# EAGLE schematic PCIe-1x-Toolcard (EAGLE 9.2.1)

## Sheet 1 of 8: PCIe x1 Edge Connector
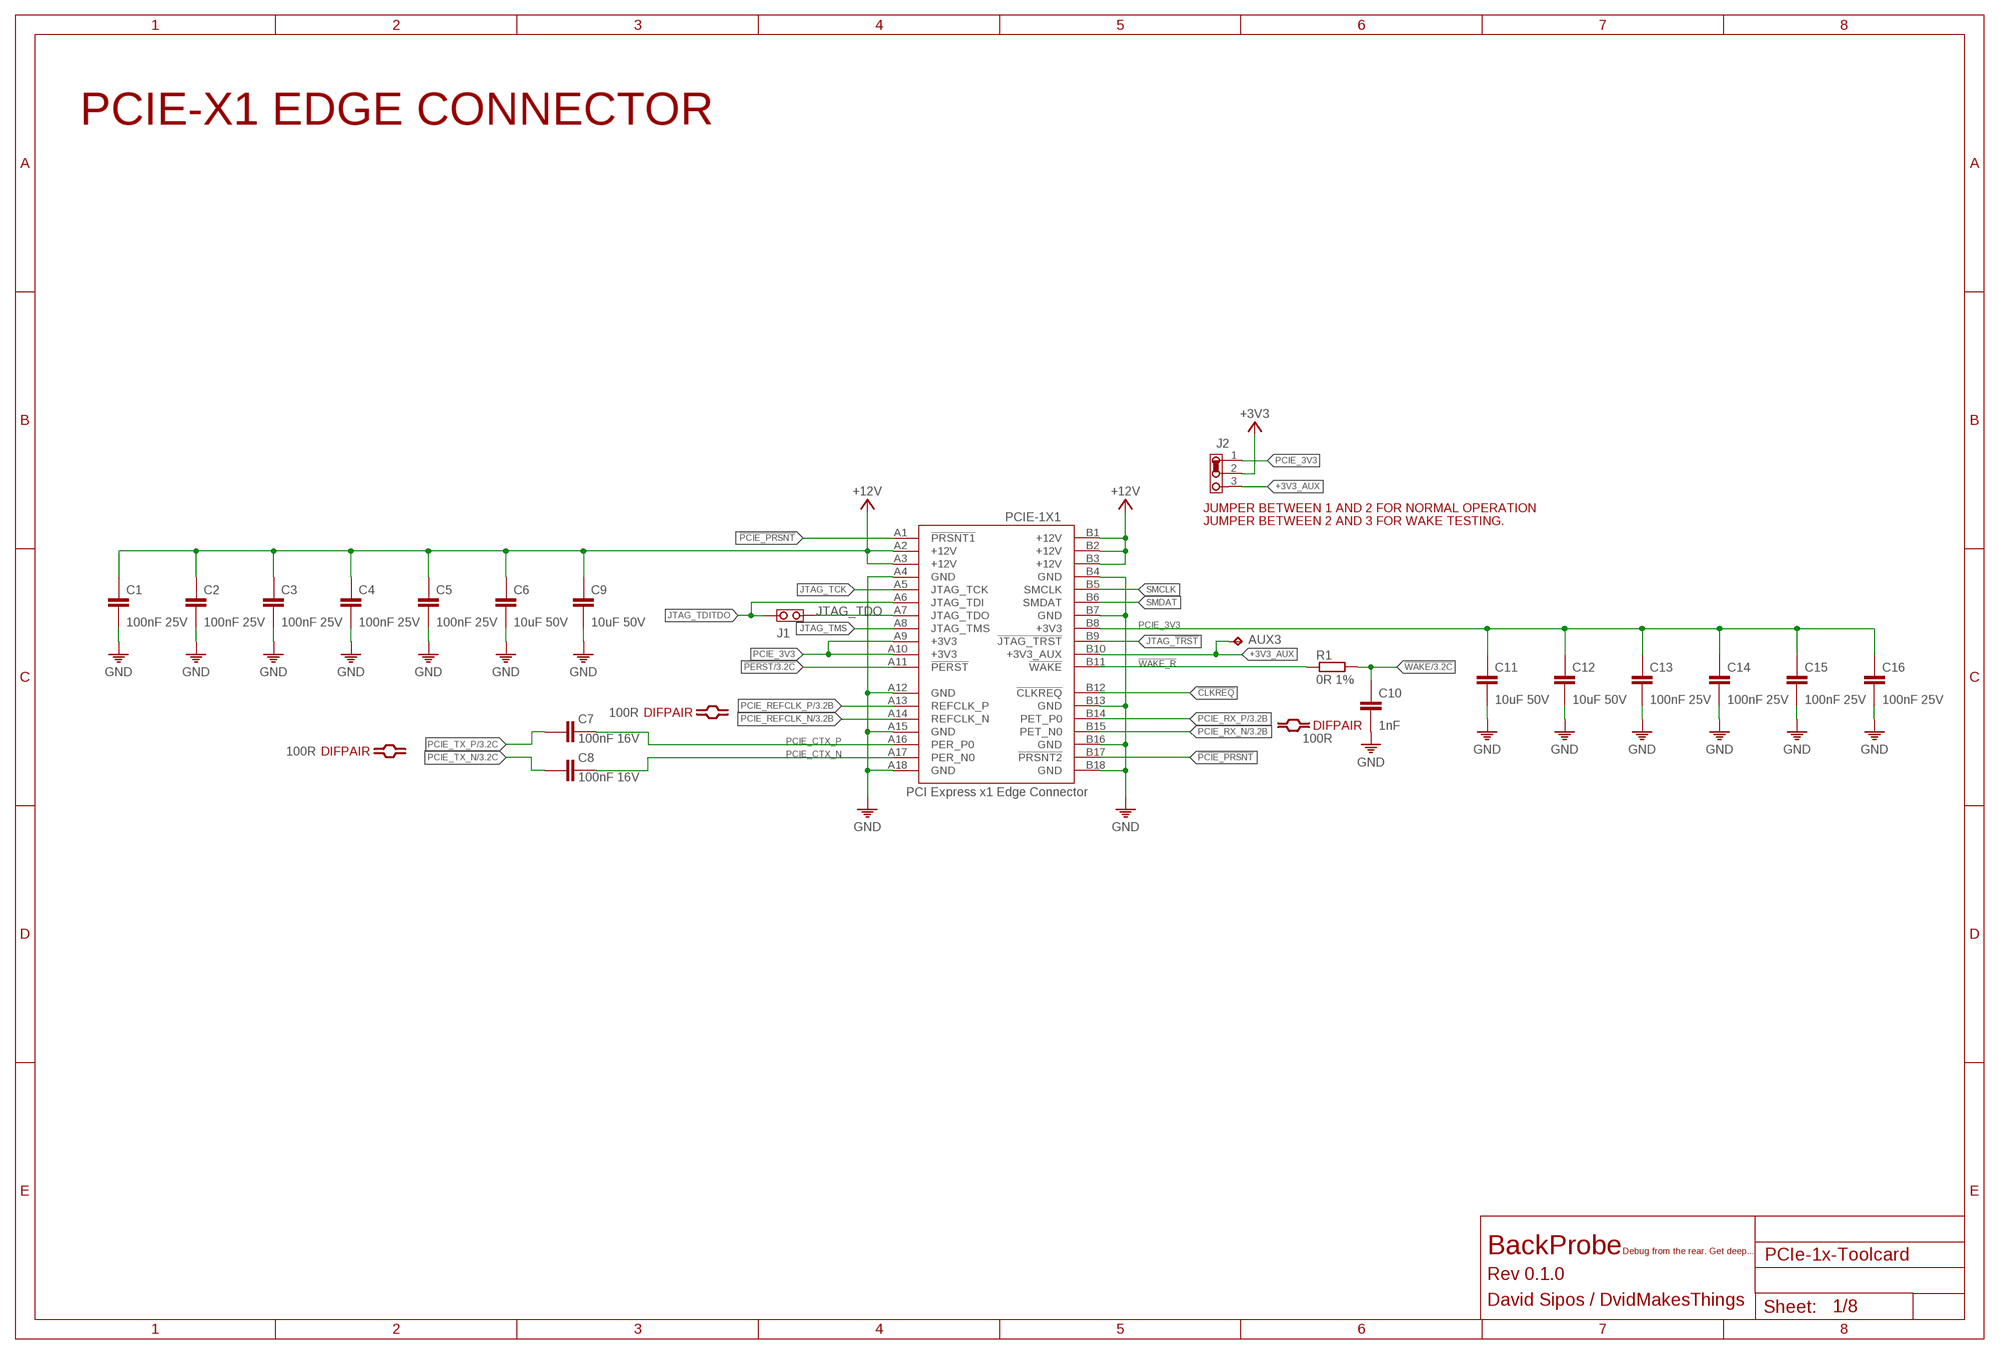
[diagram p0: schematic, sheet 1]

### Parts
AUX3  TPB1,27  [B1,27]
C1  100nF 25V  100NF-25V-0402  [0402]
C2  100nF 25V  100NF-25V-0402  [0402]
C3  100nF 25V  100NF-25V-0402  [0402]
C4  100nF 25V  100NF-25V-0402  [0402]
C5  100nF 25V  100NF-25V-0402  [0402]
C6  10uF 50V  10UF-50V-0805  [0805]
C7  100nF 16V  100NF-16V-0201  [0201]
C8  100nF 16V  100NF-16V-0201  [0201]
C9  10uF 50V  10UF-50V-0805  [0805]
C10  1nF  C-0402  [C0402]
C11  10uF 50V  10UF-50V-0805  [0805]
C12  10uF 50V  10UF-50V-0805  [0805]
C13  100nF 25V  100NF-25V-0402  [0402]
C14  100nF 25V  100NF-25V-0402  [0402]
C15  100nF 25V  100NF-25V-0402  [0402]
C16  100nF 25V  100NF-25V-0402  [0402]
J1  JUMPER-NO  [J-0402-NO]
J2  JUMPER-3  [JUMPER-3]
PCIE-1X1  PCI Express x1 Edge Connector  PCIE-1X-LOWPROFILE  [PCIE_X1_LOWPROFILE]
R1  0R 1%  0R0201  [0201]

### Nets
!CLKREQ: PCIE-1X1.B12(!CLKREQ)
!PCIE_PRSNT: PCIE-1X1.A1(!PRSNT1) PCIE-1X1.B17(!PRSNT2)
!PERST: PCIE-1X1.A11(!PERST) ; also sheet 3
!WAKE: C10.1 R1.2 ; also sheet 3
!WAKE_R: PCIE-1X1.B11(!WAKE) R1.1
+3V3: J2.2 ; also sheet 2,3,4
+3V3_AUX: AUX3.TP J2.3 PCIE-1X1.B10(+3V3_AUX)
+12V: C1.1 C2.1 C3.1 C4.1 C5.1 C6.1 C9.1 PCIE-1X1.A2(+12V) PCIE-1X1.A3(+12V) PCIE-1X1.B1(+12V) PCIE-1X1.B2(+12V) PCIE-1X1.B3(+12V) ; also sheet 4
GND: C1.2 C2.2 C3.2 C4.2 C5.2 C6.2 C9.2 C10.2 C11.2 C12.2 C13.2 C14.2 C15.2 C16.2 PCIE-1X1.A4(GND) PCIE-1X1.A12(GND) PCIE-1X1.A15(GND) PCIE-1X1.A18(GND) PCIE-1X1.B4(GND) PCIE-1X1.B7(GND) PCIE-1X1.B13(GND) PCIE-1X1.B16(GND) PCIE-1X1.B18(GND) ; also sheet 2,3,4,5,6,7,8
JTAG_!TRST: PCIE-1X1.B9(!JTAG_TRST)
JTAG_TCK: PCIE-1X1.A5(JTAG_TCK)
JTAG_TDITDO: J1.1 PCIE-1X1.A6(JTAG_TDI)
JTAG_TDO: J1.2 PCIE-1X1.A7(JTAG_TDO)
JTAG_TMS: PCIE-1X1.A8(JTAG_TMS)
PCIE_3V3: C11.1 C12.1 C13.1 C14.1 C15.1 C16.1 J2.1 PCIE-1X1.A9(+3V3) PCIE-1X1.A10(+3V3) PCIE-1X1.B8(+3V3)
PCIE_CTX_N [100R_DE]: C8.2 PCIE-1X1.A17(PER_N0)
PCIE_CTX_P [100R_DE]: C7.2 PCIE-1X1.A16(PER_P0)
PCIE_REFCLK_N [100R_DE]: PCIE-1X1.A14(REFCLK_N) ; also sheet 3
PCIE_REFCLK_P [100R_DE]: PCIE-1X1.A13(REFCLK_P) ; also sheet 3
PCIE_RX_N [100R_DE]: PCIE-1X1.B15(PET_N0) ; also sheet 3
PCIE_RX_P [100R_DE]: PCIE-1X1.B14(PET_P0) ; also sheet 3
PCIE_TX_N [100R_DE]: C8.1 ; also sheet 3
PCIE_TX_P [100R_DE]: C7.1 ; also sheet 3
SMCLK: PCIE-1X1.B5(SMCLK)
SMDAT: PCIE-1X1.B6(SMDAT)

### Notes on the sheet
- PCIE-X1 EDGE CONNECTOR
- JUMPER BETWEEN 1 AND 2 FOR NORMAL OPERATION
- JUMPER BETWEEN 2 AND 3 FOR WAKE TESTING.
- BackProbe | Debug from the rear. Get deep...
- Rev 0.1.0
- David Sipos / DvidMakesThings

## Sheet 2 of 8: TUSB7340 Power
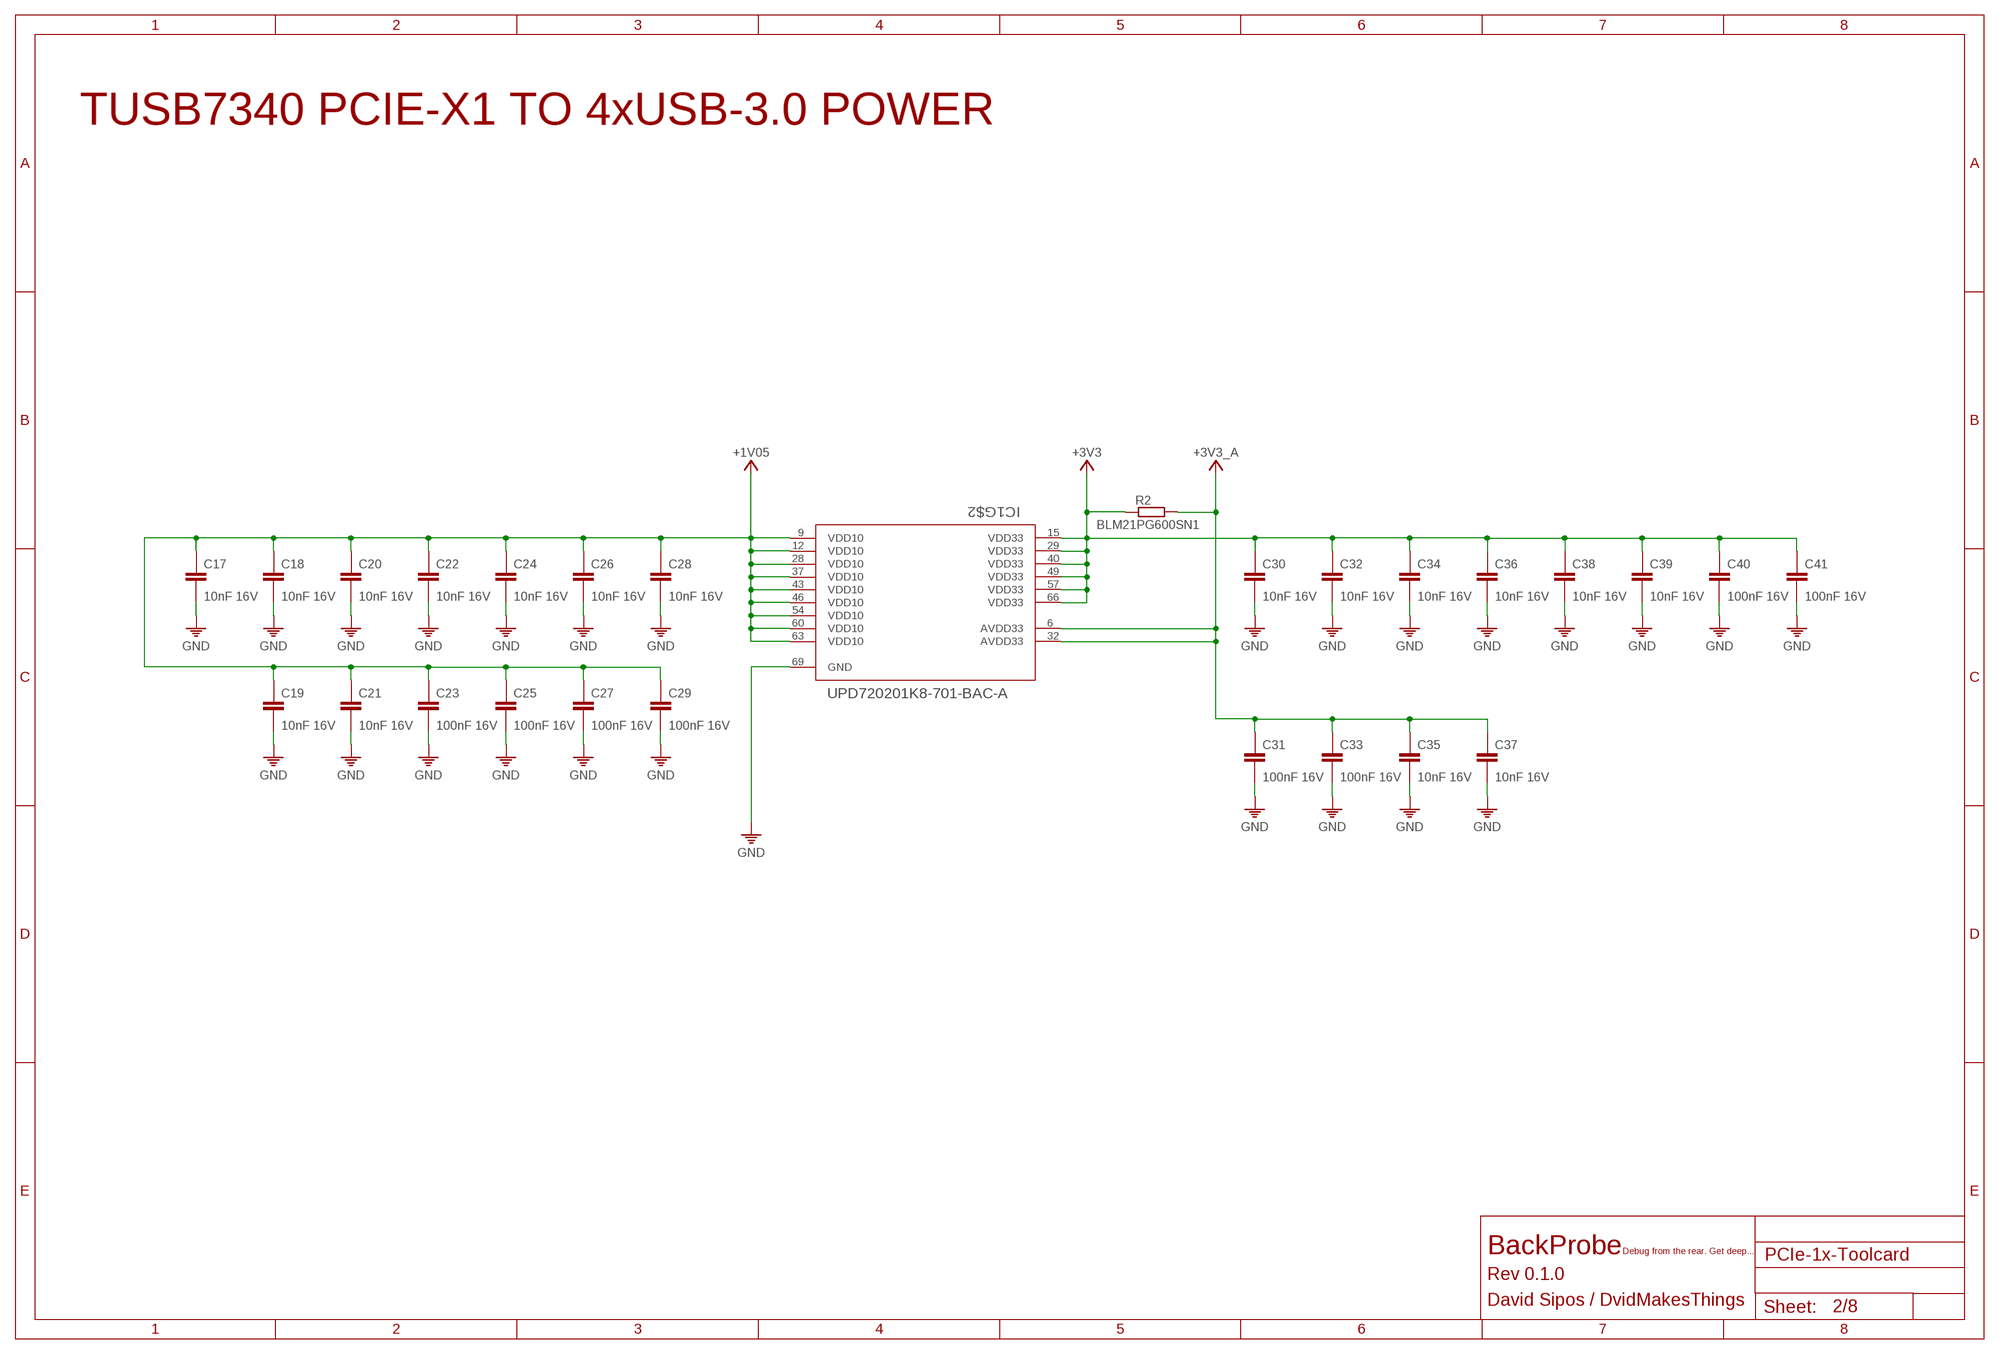
[diagram p1: schematic, sheet 2]

### Parts
C17  10nF 16V  10NF-16V-0201  [0201]
C18  10nF 16V  10NF-16V-0201  [0201]
C19  10nF 16V  10NF-16V-0201  [0201]
C20  10nF 16V  10NF-16V-0201  [0201]
C21  10nF 16V  10NF-16V-0201  [0201]
C22  10nF 16V  10NF-16V-0201  [0201]
C23  100nF 16V  100NF-16V-0201  [0201]
C24  10nF 16V  10NF-16V-0201  [0201]
C25  100nF 16V  100NF-16V-0201  [0201]
C26  10nF 16V  10NF-16V-0201  [0201]
C27  100nF 16V  100NF-16V-0201  [0201]
C28  10nF 16V  10NF-16V-0201  [0201]
C29  100nF 16V  100NF-16V-0201  [0201]
C30  10nF 16V  10NF-16V-0201  [0201]
C31  100nF 16V  100NF-16V-0201  [0201]
C32  10nF 16V  10NF-16V-0201  [0201]
C33  100nF 16V  100NF-16V-0201  [0201]
C34  10nF 16V  10NF-16V-0201  [0201]
C35  10nF 16V  10NF-16V-0201  [0201]
C36  10nF 16V  10NF-16V-0201  [0201]
C37  10nF 16V  10NF-16V-0201  [0201]
C38  10nF 16V  10NF-16V-0201  [0201]
C39  10nF 16V  10NF-16V-0201  [0201]
C40  100nF 16V  100NF-16V-0201  [0201]
C41  100nF 16V  100NF-16V-0201  [0201]
IC1  UPD720201K8-701-BAC-A  UPD720201  [QFN68-8X8]
R2  BLM21PG600SN1  R0603  [0603]

### Nets
+1V05: C17.1 C18.1 C19.1 C20.1 C21.1 C22.1 C23.1 C24.1 C25.1 C26.1 C27.1 C28.1 C29.1 IC1.9(VDD10) IC1.12(VDD10) IC1.28(VDD10) IC1.37(VDD10) IC1.43(VDD10) IC1.46(VDD10) IC1.54(VDD10) IC1.60(VDD10) IC1.63(VDD10) ; also sheet 4
+3V3: C30.1 C32.1 C34.1 C36.1 C38.1 C39.1 C40.1 C41.1 IC1.15(VDD33) IC1.29(VDD33) IC1.40(VDD33) IC1.49(VDD33) IC1.57(VDD33) IC1.66(VDD33) R2.1 ; also sheet 1,3,4
+3V3A: C31.1 C33.1 C35.1 C37.1 IC1.6(AVDD33) IC1.32(AVDD33) R2.2 ; supply symbol labelled +3V3_A
GND: C17.2 C18.2 C19.2 C20.2 C21.2 C22.2 C23.2 C24.2 C25.2 C26.2 C27.2 C28.2 C29.2 C30.2 C31.2 C32.2 C33.2 C34.2 C35.2 C36.2 C37.2 C38.2 C39.2 C40.2 C41.2 IC1.69(GND) ; also sheet 1,3,4,5,6,7,8

### Notes on the sheet
- TUSB7340 PCIE-X1 TO 4xUSB-3.0 POWER
- BackProbe | Debug from the rear. Get deep...
- Rev 0.1.0
- David Sipos / DvidMakesThings

## Sheet 3 of 8: TUSB7340 Wiring
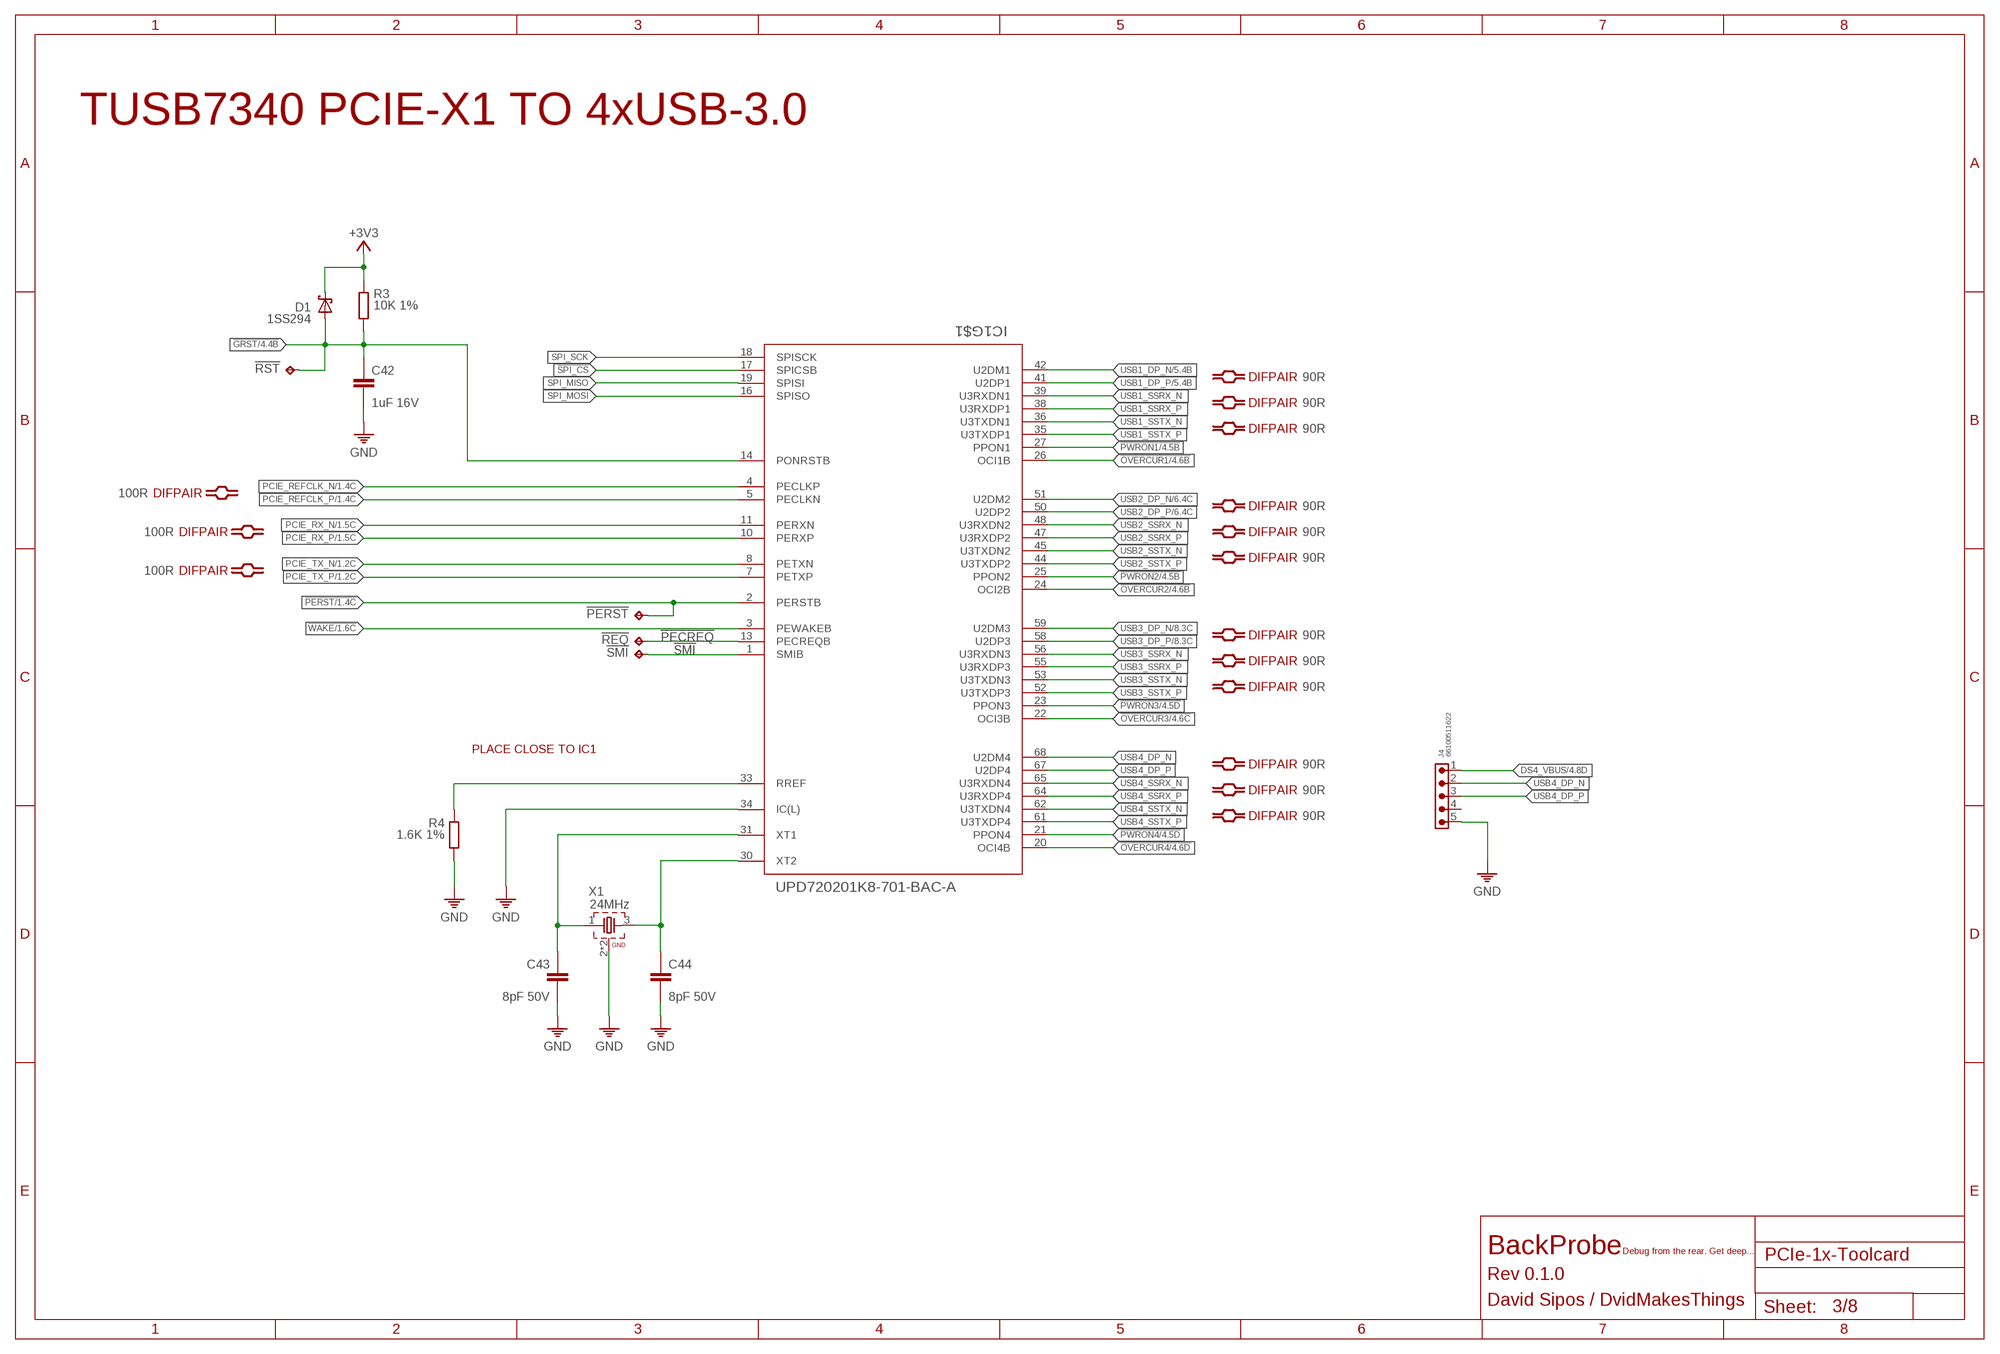
[diagram p2: schematic, sheet 3]

### Parts
!PERST  TPB1,27  [B1,27]
!REQ  TPB1,27  [B1,27]
!RST  TPB1,27  [B1,27]
!SMI  TPB1,27  [B1,27]
C42  1uF 16V  1UF-16V0201  [0201]
C43  8pF 50V  8PF-50V0201  [0201]
C44  8pF 50V  8PF-50V0201  [0201]
D1  1SS294  BAT54  [SOT23]
J4  66100511622  66100511622  [66100511622]
R3  10K 1%  10K-1%0201  [0201]
R4  1.6K 1%  1.6K-1%0201  [0201]
X1  24MHz  WE-XTAL_CFPX-180_830108207709  [WE-XTAL_CFPX-180]

### Nets
!GRST: !RST.TP C42.1 D1.1(A) IC1.14(PONRSTB) R3.2 ; also sheet 4
!OVERCUR1: IC1.26(OCI1B) ; also sheet 4
!OVERCUR2: IC1.24(OCI2B) ; also sheet 4
!OVERCUR3: IC1.22(OCI3B) ; also sheet 4
!OVERCUR4: IC1.20(OCI4B) ; also sheet 4
!PECREQ: !REQ.TP IC1.13(PECREQB)
!PERST: !PERST.TP IC1.2(PERSTB) ; also sheet 1
!PWRON1: IC1.27(PPON1) ; also sheet 4
!PWRON2: IC1.25(PPON2) ; also sheet 4
!PWRON3: IC1.23(PPON3) ; also sheet 4
!PWRON4: IC1.21(PPON4) ; also sheet 4
!SMI: !SMI.TP IC1.1(SMIB)
!SPI_CS: IC1.17(SPICSB)
!WAKE: IC1.3(PEWAKEB) ; also sheet 1
+3V3: D1.3(C) R3.1 ; also sheet 1,2,4
DS4_VBUS: J4.1 ; also sheet 4
GND: C42.2 C43.2 C44.2 IC1.34(IC(L)) J4.5 R4.2 X1.2(GND) X1.4(GND) ; also sheet 1,2,4,5,6,7,8
N$4: C43.1 IC1.31(XT1) X1.1
N$5: C44.1 IC1.30(XT2) X1.3
N$60: IC1.33(RREF) R4.1
PCIE_REFCLK_N [100R_DE]: IC1.4(PECLKP) ; also sheet 1
PCIE_REFCLK_P [100R_DE]: IC1.5(PECLKN) ; also sheet 1
PCIE_RX_N [100R_DE]: IC1.11(PERXN) ; also sheet 1
PCIE_RX_P [100R_DE]: IC1.10(PERXP) ; also sheet 1
PCIE_TX_N [100R_DE]: IC1.8(PETXN) ; also sheet 1
PCIE_TX_P [100R_DE]: IC1.7(PETXP) ; also sheet 1
SPI_MISO: IC1.19(SPISI)
SPI_MOSI: IC1.16(SPISO)
SPI_SCK: IC1.18(SPISCK)
USB1_DP_N [90R_DE]: IC1.42(U2DM1) ; also sheet 5
USB1_DP_P [90R_DE]: IC1.41(U2DP1) ; also sheet 5
USB1_SSRX_N [90R_DE]: IC1.39(U3RXDN1)
USB1_SSRX_P [90R_DE]: IC1.38(U3RXDP1)
USB1_SSTX_N [90R_DE]: IC1.36(U3TXDN1)
USB1_SSTX_P [90R_DE]: IC1.35(U3TXDP1)
USB2_DP_N [90R_DE]: IC1.51(U2DM2) ; also sheet 6
USB2_DP_P [90R_DE]: IC1.50(U2DP2) ; also sheet 6
USB2_SSRX_N [90R_DE]: IC1.48(U3RXDN2)
USB2_SSRX_P [90R_DE]: IC1.47(U3RXDP2)
USB2_SSTX_N [90R_DE]: IC1.45(U3TXDN2)
USB2_SSTX_P [90R_DE]: IC1.44(U3TXDP2)
USB3_DP_N [90R_DE]: IC1.59(U2DM3) ; also sheet 8
USB3_DP_P [90R_DE]: IC1.58(U2DP3) ; also sheet 8
USB3_SSRX_N [90R_DE]: IC1.56(U3RXDN3)
USB3_SSRX_P [90R_DE]: IC1.55(U3RXDP3)
USB3_SSTX_N [90R_DE]: IC1.53(U3TXDN3)
USB3_SSTX_P [90R_DE]: IC1.52(U3TXDP3)
USB4_DP_N [90R_DE]: IC1.68(U2DM4) J4.2
USB4_DP_P [90R_DE]: IC1.67(U2DP4) J4.3
USB4_SSRX_N [90R_DE]: IC1.65(U3RXDN4)
USB4_SSRX_P [90R_DE]: IC1.64(U3RXDP4)
USB4_SSTX_N [90R_DE]: IC1.62(U3TXDN4)
USB4_SSTX_P [90R_DE]: IC1.61(U3TXDP4)
Unconnected: J4.4

### Notes on the sheet
- TUSB7340 PCIE-X1 TO 4xUSB-3.0
- PLACE CLOSE TO IC1
- BackProbe | Debug from the rear. Get deep...
- Rev 0.1.0
- David Sipos / DvidMakesThings

## Sheet 4 of 8: Power Management
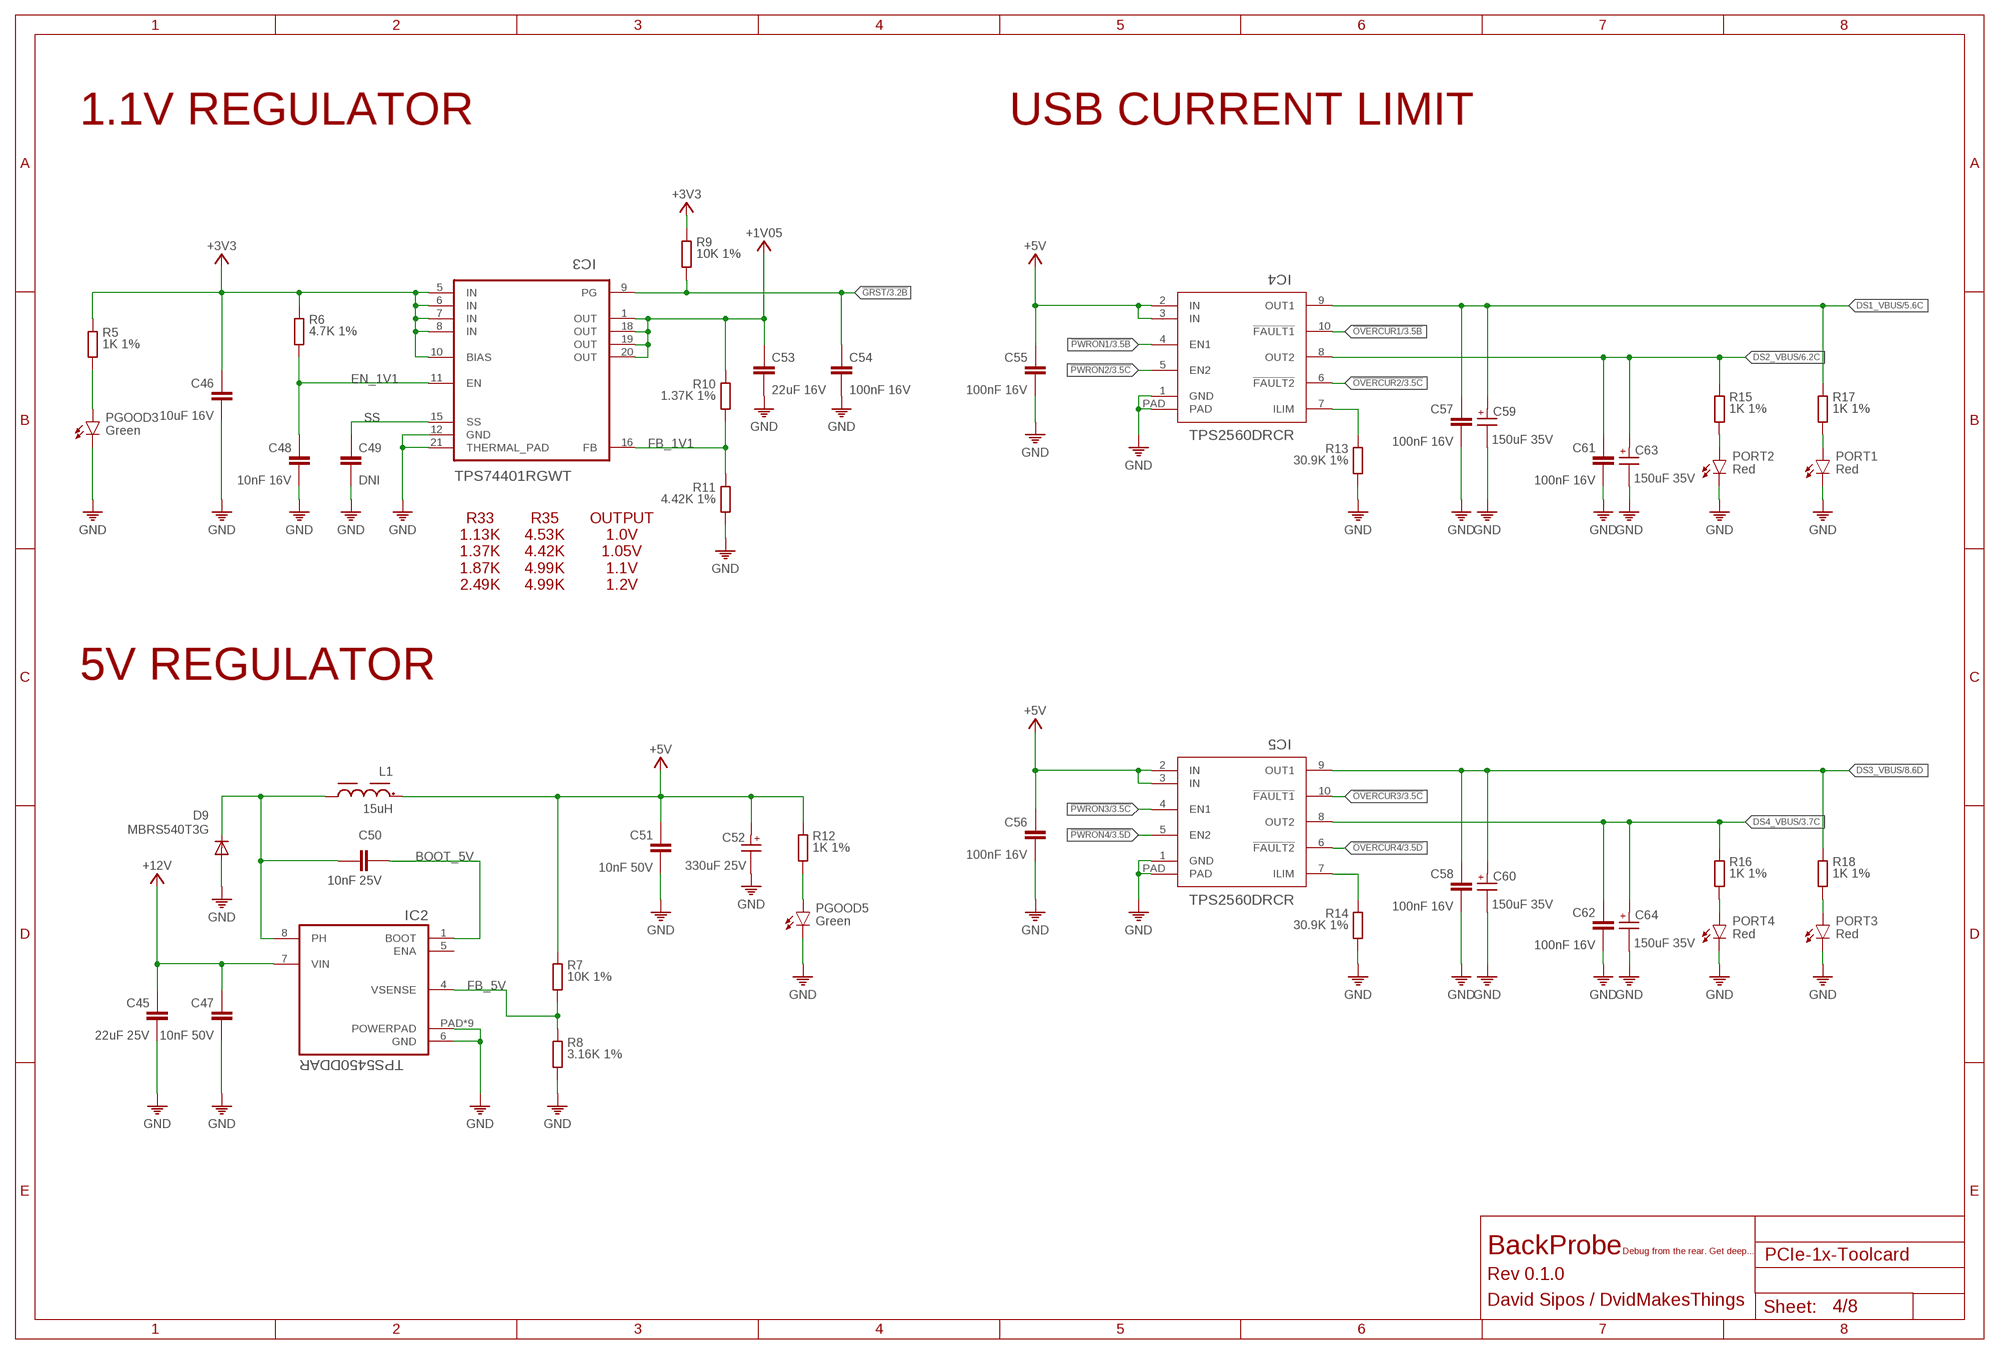
[diagram p3: schematic, sheet 4]

### Parts
C45  22uF 25V  22UF-25V-0805  [0805]
C46  10uF 16V  10UF-16V-0805  [0805]
C47  10nF 50V  10NF-50V-0805  [0805]
C48  10nF 16V  10NF-16V-0201  [0201]
C49  DNI  C-0201  [0201]
C50  10nF 25V  10NF-25V-0402  [0402]
C51  10nF 50V  10NF-50V-0805  [0805]
C52  330uF 25V  330UF-25V6.3X7.7(DXL)  [6.3X7.7(DXL)]
C53  22uF 16V  22UF-16V-0805  [0805]
C54  100nF 16V  100NF-16V-0201  [0201]
C55  100nF 16V  100NF-16V-0201  [0201]
C56  100nF 16V  100NF-16V-0201  [0201]
C57  100nF 16V  100NF-16V-0201  [0201]
C58  100nF 16V  100NF-16V-0201  [0201]
C59  150uF 35V  150UF-35V-6.3X5.5  [6.3X5.5(DXL)]
C60  150uF 35V  150UF-35V-6.3X5.5  [6.3X5.5(DXL)]
C61  100nF 16V  100NF-16V-0201  [0201]
C62  100nF 16V  100NF-16V-0201  [0201]
C63  150uF 35V  150UF-35V-6.3X5.5  [6.3X5.5(DXL)]
C64  150uF 35V  150UF-35V-6.3X5.5  [6.3X5.5(DXL)]
D9  MBRS540T3G  DIODE-SMC  [SMC]
IC2  TPS5450DDAR  TPS5450  [8-POWERSOIC]
IC3  TPS74401RGWT  [VQFN20-5X5]
IC4  TPS2560DRCR  [VSON10-3X3]
IC5  TPS2560DRCR  [VSON10-3X3]
L1  15uH  15UHL-10X10  [L-10X10]
PGOOD3  Green  LED-GREENLED-0603  [LED-0603]
PGOOD5  Green  LED-GREENLED-0603  [LED-0603]
PORT1  Red  LED-REDLED-0603  [LED-0603]
PORT2  Red  LED-REDLED-0603  [LED-0603]
PORT3  Red  LED-REDLED-0603  [LED-0603]
PORT4  Red  LED-REDLED-0603  [LED-0603]
R5  1K 1%  1K-1%0402  [0402]
R6  4.7K 1%  4.7K-1%0201  [0201]
R7  10K 1%  10K-1%0402  [0402]
R8  3.16K 1%  3.16K-1%0402  [0402]
R9  10K 1%  10K-1%0201  [0201]
R10  1.37K 1%  1.37K-1%0201  [0201]
R11  4.42K 1%  4.42K-1%0201  [0201]
R12  1K 1%  1K-1%0402  [0402]
R13  30.9K 1%  30.9K-1%0201  [0201]
R14  30.9K 1%  30.9K-1%0201  [0201]
R15  1K 1%  1K-1%0402  [0402]
R16  1K 1%  1K-1%0402  [0402]
R17  1K 1%  1K-1%0402  [0402]
R18  1K 1%  1K-1%0402  [0402]

### Nets
!GRST: C54.1 IC3.9(PG) R9.2 ; also sheet 3
!OVERCUR1: IC4.10(!FAULT1) ; also sheet 3
!OVERCUR2: IC4.6(!FAULT2) ; also sheet 3
!OVERCUR3: IC5.10(!FAULT1) ; also sheet 3
!OVERCUR4: IC5.6(!FAULT2) ; also sheet 3
!PWRON1: IC4.4(EN1) ; also sheet 3
!PWRON2: IC4.5(EN2) ; also sheet 3
!PWRON3: IC5.4(EN1) ; also sheet 3
!PWRON4: IC5.5(EN2) ; also sheet 3
+1V05: C53.1 IC3.1(OUT) IC3.18(OUT) IC3.19(OUT) IC3.20(OUT) R10.1 ; also sheet 2
+3V3: C46.1 IC3.5(IN) IC3.6(IN) IC3.7(IN) IC3.8(IN) IC3.10(BIAS) R5.1 R6.1 R9.1 ; also sheet 1,2,3
+5V: C51.1 C52.1(+) C55.1 C56.1 IC4.2(IN) IC4.3(IN) IC5.2(IN) IC5.3(IN) L1.1 R7.1 R12.1
+12V: C45.1 C47.1 IC2.7(VIN) ; also sheet 1
BOOT_5V: C50.1 IC2.1(BOOT)
DS1_VBUS: C57.1 C59.1(+) IC4.9(OUT1) R17.1 ; also sheet 5
DS2_VBUS: C61.1 C63.1(+) IC4.8(OUT2) R15.1 ; also sheet 6,7
DS3_VBUS: C58.1 C60.1(+) IC5.9(OUT1) R18.1 ; also sheet 8
DS4_VBUS: C62.1 C64.1(+) IC5.8(OUT2) R16.1 ; also sheet 3
EN_1V1: C48.1 IC3.11(EN) R6.2
FB_1V1: IC3.16(FB) R10.2 R11.1
FB_5V: IC2.4(VSENSE) R7.2 R8.1
GND: C45.2 C46.2 C47.2 C48.2 C49.2 C51.2 C52.2(-) C53.2 C54.2 C55.2 C56.2 C57.2 C58.2 C59.2(-) C60.2(-) C61.2 C62.2 C63.2(-) C64.2(-) D9.A IC2.6(GND) IC2.PAD(POWERPAD) IC2.V1(POWERPAD) IC2.V2(POWERPAD) IC2.V3(POWERPAD) IC2.V4(POWERPAD) IC2.V5(POWERPAD) IC2.V6(POWERPAD) IC2.V7(POWERPAD) IC2.V8(POWERPAD) IC3.12(GND) IC3.21(THERMAL_PAD) IC4.1(GND) IC4.PAD IC5.1(GND) IC5.PAD PGOOD3.C PGOOD5.C PORT1.C PORT2.C PORT3.C PORT4.C R8.2 R11.2 R13.2 R14.2 ; also sheet 1,2,3,5,6,7,8
ILIM12: IC4.7(ILIM) R13.1
ILIM34: IC5.7(ILIM) R14.1
LED_3V: PGOOD3.A R5.2
LED_5V: PGOOD5.A R12.2
LEDDS1: PORT2.A R15.2
LEDDS2: PORT3.A R18.2
LEDDS3: PORT1.A R17.2
LEDDS4: PORT4.A R16.2
PH: C50.2 D9.C IC2.8(PH) L1.2
SS: C49.1 IC3.15(SS)
Unconnected: IC2.5(ENA)

### Notes on the sheet
- 1.1V REGULATOR | USB CURRENT LIMIT
- R33
  1.13K
  1.37K
  1.87K
  2.49K
- R35
  4.53K
  4.42K
  4.99K
  4.99K
- OUTPUT
  1.0V
  1.05V
  1.1V
  1.2V
- 5V REGULATOR
- BackProbe | Debug from the rear. Get deep...
- Rev 0.1.0
- David Sipos / DvidMakesThings

## Sheet 5 of 8: Downstream port 1
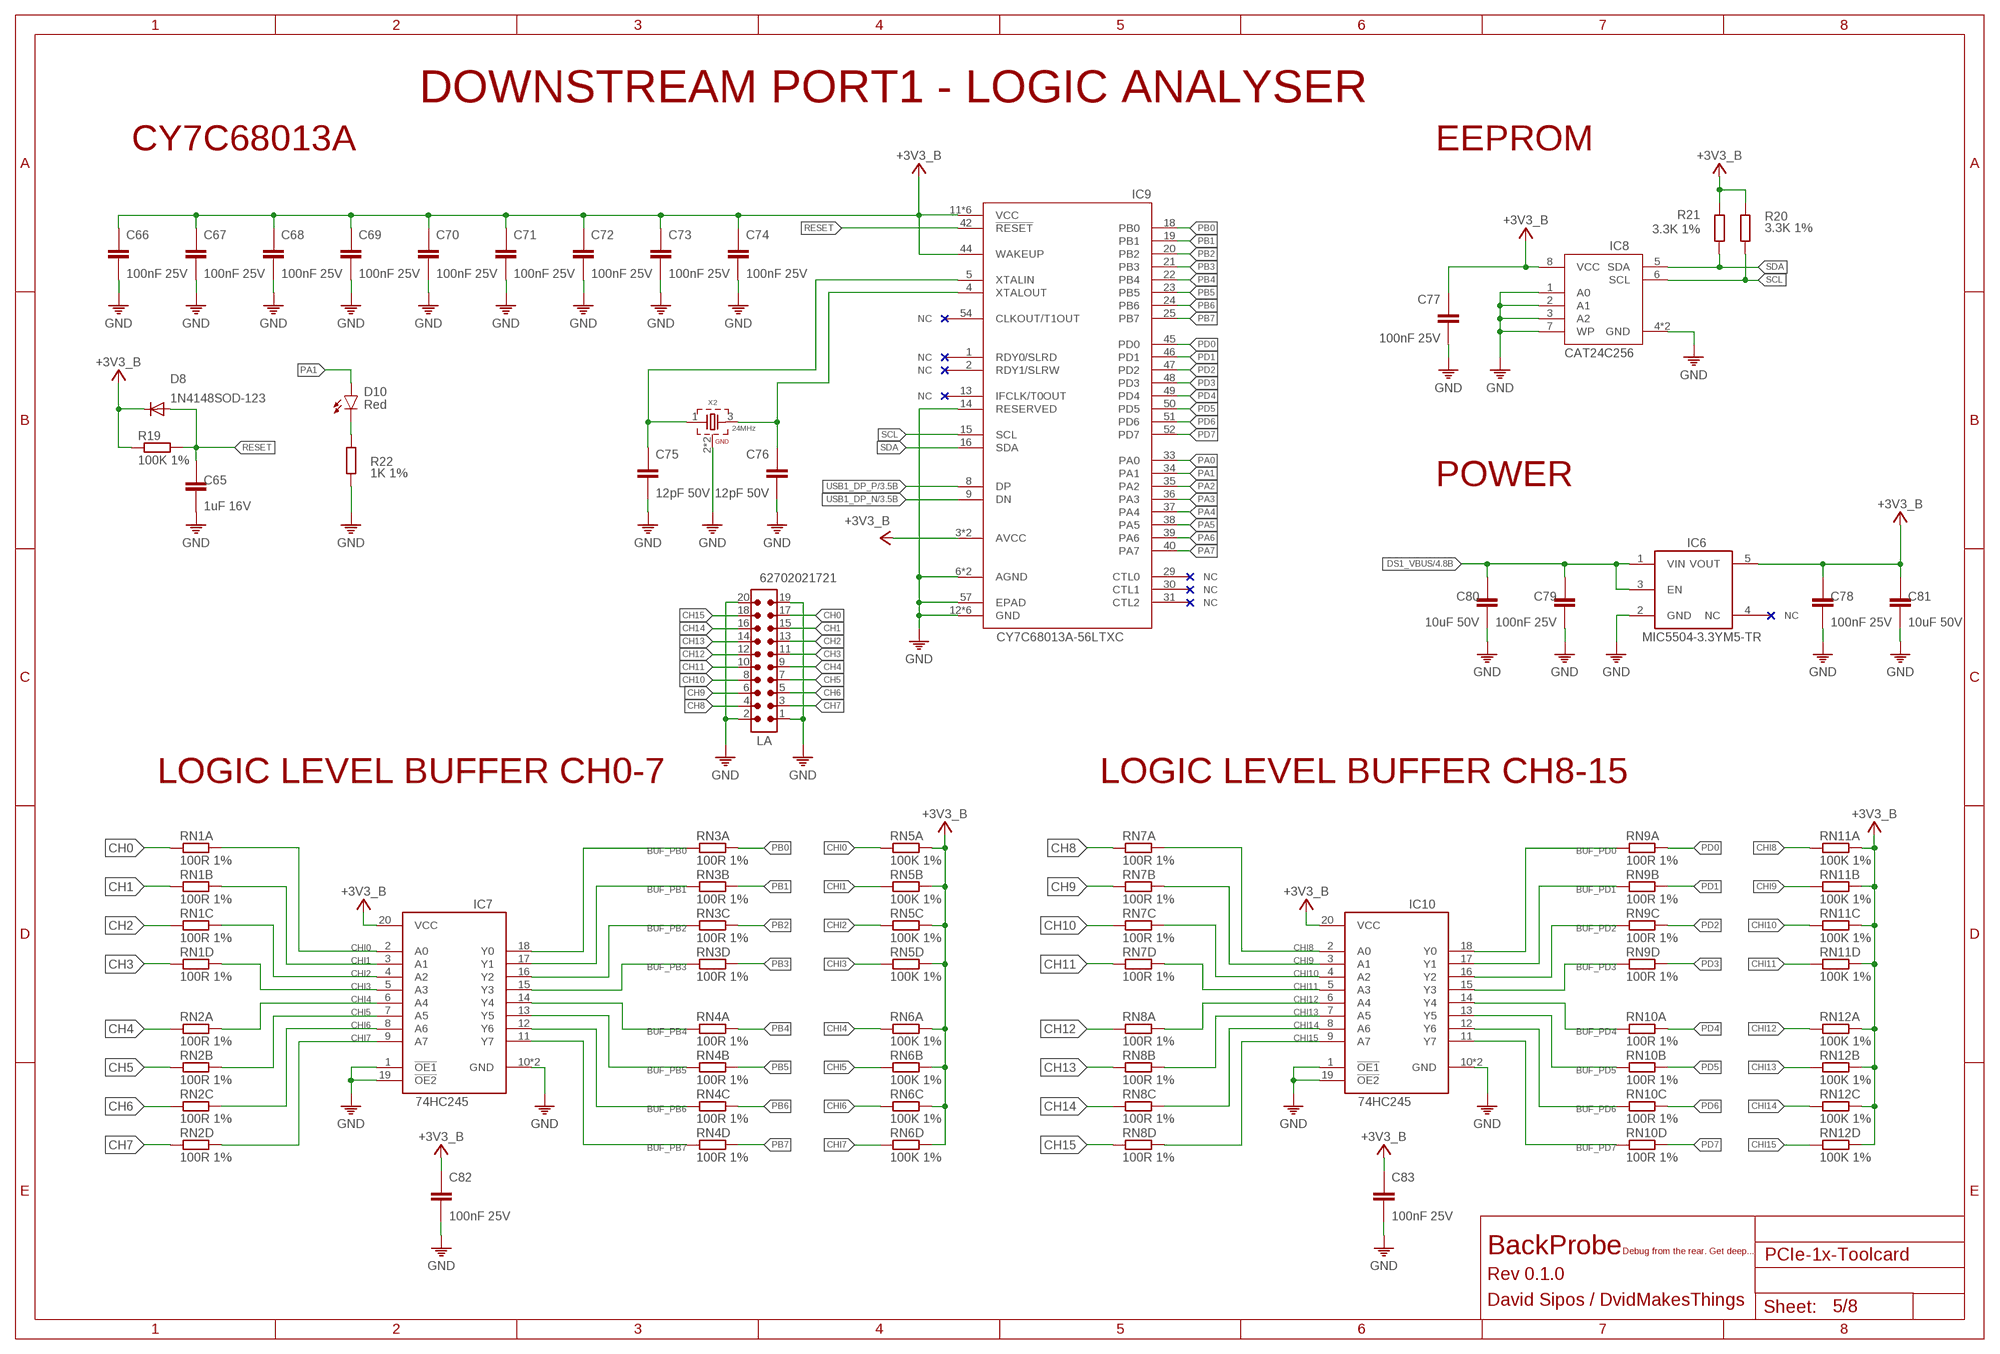
[diagram p4: schematic, sheet 5]

### Parts
C65  1uF 16V  1UF-16V0201  [0201]
C66  100nF 25V  100NF-25V-0201  [0201]
C67  100nF 25V  100NF-25V-0201  [0201]
C68  100nF 25V  100NF-25V-0201  [0201]
C69  100nF 25V  100NF-25V-0201  [0201]
C70  100nF 25V  100NF-25V-0201  [0201]
C71  100nF 25V  100NF-25V-0201  [0201]
C72  100nF 25V  100NF-25V-0201  [0201]
C73  100nF 25V  100NF-25V-0201  [0201]
C74  100nF 25V  100NF-25V-0201  [0201]
C75  12pF 50V  12PF-50V0201  [0201]
C76  12pF 50V  12PF-50V0201  [0201]
C77  100nF 25V  100NF-25V-0201  [0201]
C78  100nF 25V  100NF-25V-0201  [0201]
C79  100nF 25V  100NF-25V-0201  [0201]
C80  10uF 50V  10UF-50V-0805  [0805]
C81  10uF 50V  10UF-50V-0805  [0805]
C82  100nF 25V  100NF-25V-0201  [0201]
C83  100nF 25V  100NF-25V-0201  [0201]
D8  1N4148SOD-123  DIODE_SOD-123FL  [SOD-123FL]
D10  Red  LED-REDLED-0603  [LED-0603]
IC6  MIC5504-3.3YM5-TR  [SOT23-5]
IC7  SN74LVC541ARGYR  74LVC541A  [QFN50P350X450X100-25T305X205N]
IC8  CAT24C256HU4IGT3  CAT24C256-HU4  [SON50P300X200X50-9T130X140N]
IC9  CY7C68013A-56LTXC  CY7C68013A-56QFNLFXC  [QFN50P800X800X100-57T665]
IC10  SN74LVC541ARGYR  74LVC541A  [QFN50P350X450X100-25T305X205N]
LA  62702021721  6270XX21721_62702021721  [62702021721]
R19  100K 1%  100K-1%0201  [0201]
R20  3.3K 1%  3.3K-1%0201  [0201]
R21  3.3K 1%  3.3K-1%0201  [0201]
R22  1K 1%  1K-1%0402  [0402]
RN1  100R 1%  100R-1%_ARRAY0603X4-1206  [0603X4-1206]
RN2  100R 1%  100R-1%_ARRAY0603X4-1206  [0603X4-1206]
RN3  100R 1%  100R-1%_ARRAY0603X4-1206  [0603X4-1206]
RN4  100R 1%  100R-1%_ARRAY0603X4-1206  [0603X4-1206]
RN5  100K 1%  100K-1%_ARRAY0603X4-1206  [0603X4-1206]
RN6  100K 1%  100K-1%_ARRAY0603X4-1206  [0603X4-1206]
RN7  100R 1%  100R-1%_ARRAY0603X4-1206  [0603X4-1206]
RN8  100R 1%  100R-1%_ARRAY0603X4-1206  [0603X4-1206]
RN9  100R 1%  100R-1%_ARRAY0603X4-1206  [0603X4-1206]
RN10  100R 1%  100R-1%_ARRAY0603X4-1206  [0603X4-1206]
RN11  100K 1%  100K-1%_ARRAY0603X4-1206  [0603X4-1206]
RN12  100K 1%  100K-1%_ARRAY0603X4-1206  [0603X4-1206]
X2  24MHz  WE-XTAL_CFPX-180_830058149  [WE-XTAL_CFPX-180]

### Nets
+3V3B: C66.1 C67.1 C68.1 C69.1 C70.1 C71.1 C72.1 C73.1 C74.1 C77.1 C78.1 C81.1 C82.1 C83.1 D8.C IC6.5(VOUT) IC7.20(VCC) IC8.8(VCC) IC9.3(AVCC) IC9.7(AVCC) IC9.11(VCC) IC9.17(VCC) IC9.27(VCC) IC9.32(VCC) IC9.43(VCC) IC9.44(WAKEUP) IC9.55(VCC) IC10.20(VCC) R19.1 R20.2 R21.2 RN5.A2 RN5.B2 RN5.C2 RN5.D2 RN6.A2 RN6.B2 RN6.C2 RN6.D2 RN11.A2 RN11.B2 RN11.C2 RN11.D2 RN12.A2 RN12.B2 RN12.C2 RN12.D2 ; supply symbol labelled +3V3_B
BUF_PB0: IC7.18(Y0) RN3.A1
BUF_PB1: IC7.17(Y1) RN3.B1
BUF_PB2: IC7.16(Y2) RN3.C1
BUF_PB3: IC7.15(Y3) RN3.D1
BUF_PB4: IC7.14(Y4) RN4.A1
BUF_PB5: IC7.13(Y5) RN4.B1
BUF_PB6: IC7.12(Y6) RN4.C1
BUF_PB7: IC7.11(Y7) RN4.D1
BUF_PD0: IC10.18(Y0) RN9.A1
BUF_PD1: IC10.17(Y1) RN9.B1
BUF_PD2: IC10.16(Y2) RN9.C1
BUF_PD3: IC10.15(Y3) RN9.D1
BUF_PD4: IC10.14(Y4) RN10.A1
BUF_PD5: IC10.13(Y5) RN10.B1
BUF_PD6: IC10.12(Y6) RN10.C1
BUF_PD7: IC10.11(Y7) RN10.D1
CH0: LA.17 RN1.A1
CH1: LA.15 RN1.B1
CH2: LA.13 RN1.C1
CH3: LA.11 RN1.D1
CH4: LA.9 RN2.A1
CH5: LA.7 RN2.B1
CH6: LA.5 RN2.C1
CH7: LA.3 RN2.D1
CH8: LA.4 RN7.A1
CH9: LA.6 RN7.B1
CH10: LA.8 RN7.C1
CH11: LA.10 RN7.D1
CH12: LA.12 RN8.A1
CH13: LA.14 RN8.B1
CH14: LA.16 RN8.C1
CH15: LA.18 RN8.D1
CHI0: IC7.2(A0) RN1.A2 RN5.A1
CHI1: IC7.3(A1) RN1.B2 RN5.B1
CHI2: IC7.4(A2) RN1.C2 RN5.C1
CHI3: IC7.5(A3) RN1.D2 RN5.D1
CHI4: IC7.6(A4) RN2.A2 RN6.A1
CHI5: IC7.7(A5) RN2.B2 RN6.B1
CHI6: IC7.8(A6) RN2.C2 RN6.C1
CHI7: IC7.9(A7) RN2.D2 RN6.D1
CHI8: IC10.2(A0) RN7.A2 RN11.A1
CHI9: IC10.3(A1) RN7.B2 RN11.B1
CHI10: IC10.4(A2) RN7.C2 RN11.C1
CHI11: IC10.5(A3) RN7.D2 RN11.D1
CHI12: IC10.6(A4) RN8.A2 RN12.A1
CHI13: IC10.7(A5) RN8.B2 RN12.B1
CHI14: IC10.8(A6) RN8.C2 RN12.C1
CHI15: IC10.9(A7) RN8.D2 RN12.D1
DS1_VBUS: C79.1 C80.1 IC6.1(VIN) IC6.3(EN) ; also sheet 4
GND: C65.2 C66.2 C67.2 C68.2 C69.2 C70.2 C71.2 C72.2 C73.2 C74.2 C75.2 C76.2 C77.2 C78.2 C79.2 C80.2 C81.2 C82.2 C83.2 IC6.2(GND) IC7.1(!OE1) IC7.10(GND) IC7.19(!OE2) IC7.PAD(GND) IC8.1(A0) IC8.2(A1) IC8.3(A2) IC8.4(GND) IC8.7(WP) IC8.9(GND) IC9.6(AGND) IC9.10(AGND) IC9.12(GND) IC9.14(RESERVED) IC9.26(GND) IC9.28(GND) IC9.41(GND) IC9.53(GND) IC9.56(GND) IC9.57(EPAD) IC10.1(!OE1) IC10.10(GND) IC10.19(!OE2) IC10.PAD(GND) LA.1 LA.2 LA.19 LA.20 R22.2 X2.2(GND) X2.4(GND) ; also sheet 1,2,3,4,6,7,8
LA_LED: D10.C R22.1
PA0: IC9.33(PA0)
PA1: D10.A IC9.34(PA1)
PA2: IC9.35(PA2)
PA3: IC9.36(PA3)
PA4: IC9.37(PA4)
PA5: IC9.38(PA5)
PA6: IC9.39(PA6)
PA7: IC9.40(PA7)
PB0: IC9.18(PB0) RN3.A2
PB1: IC9.19(PB1) RN3.B2
PB2: IC9.20(PB2) RN3.C2
PB3: IC9.21(PB3) RN3.D2
PB4: IC9.22(PB4) RN4.A2
PB5: IC9.23(PB5) RN4.B2
PB6: IC9.24(PB6) RN4.C2
PB7: IC9.25(PB7) RN4.D2
PD0: IC9.45(PD0) RN9.A2
PD1: IC9.46(PD1) RN9.B2
PD2: IC9.47(PD2) RN9.C2
PD3: IC9.48(PD3) RN9.D2
PD4: IC9.49(PD4) RN10.A2
PD5: IC9.50(PD5) RN10.B2
PD6: IC9.51(PD6) RN10.C2
PD7: IC9.52(PD7) RN10.D2
RESET: C65.1 D8.A IC9.42(!RESET) R19.2
SCL: IC8.6(SCL) IC9.15(SCL) R20.1
SDA: IC8.5(SDA) IC9.16(SDA) R21.1
USB1_DP_N [90R_DE]: IC9.9(DN) ; also sheet 3
USB1_DP_P [90R_DE]: IC9.8(DP) ; also sheet 3
XIN: C75.1 IC9.5(XTALIN) X2.1
XOUT: C76.1 IC9.4(XTALOUT) X2.3
Unconnected: IC6.4(NC) IC9.1(RDY0/SLRD) IC9.2(RDY1/SLRW) IC9.13(IFCLK/T0OUT) IC9.29(CTL0) IC9.30(CTL1) IC9.31(CTL2) IC9.54(CLKOUT/T1OUT)

### Notes on the sheet
- DOWNSTREAM PORT1 - LOGIC ANALYSER
- CY7C68013A | EEPROM
- POWER
- LOGIC LEVEL BUFFER CH0-7 | LOGIC LEVEL BUFFER CH8-15
- BackProbe | Debug from the rear. Get deep...
- Rev 0.1.0
- David Sipos / DvidMakesThings

## Sheet 6 of 8: Downstream port 2/1
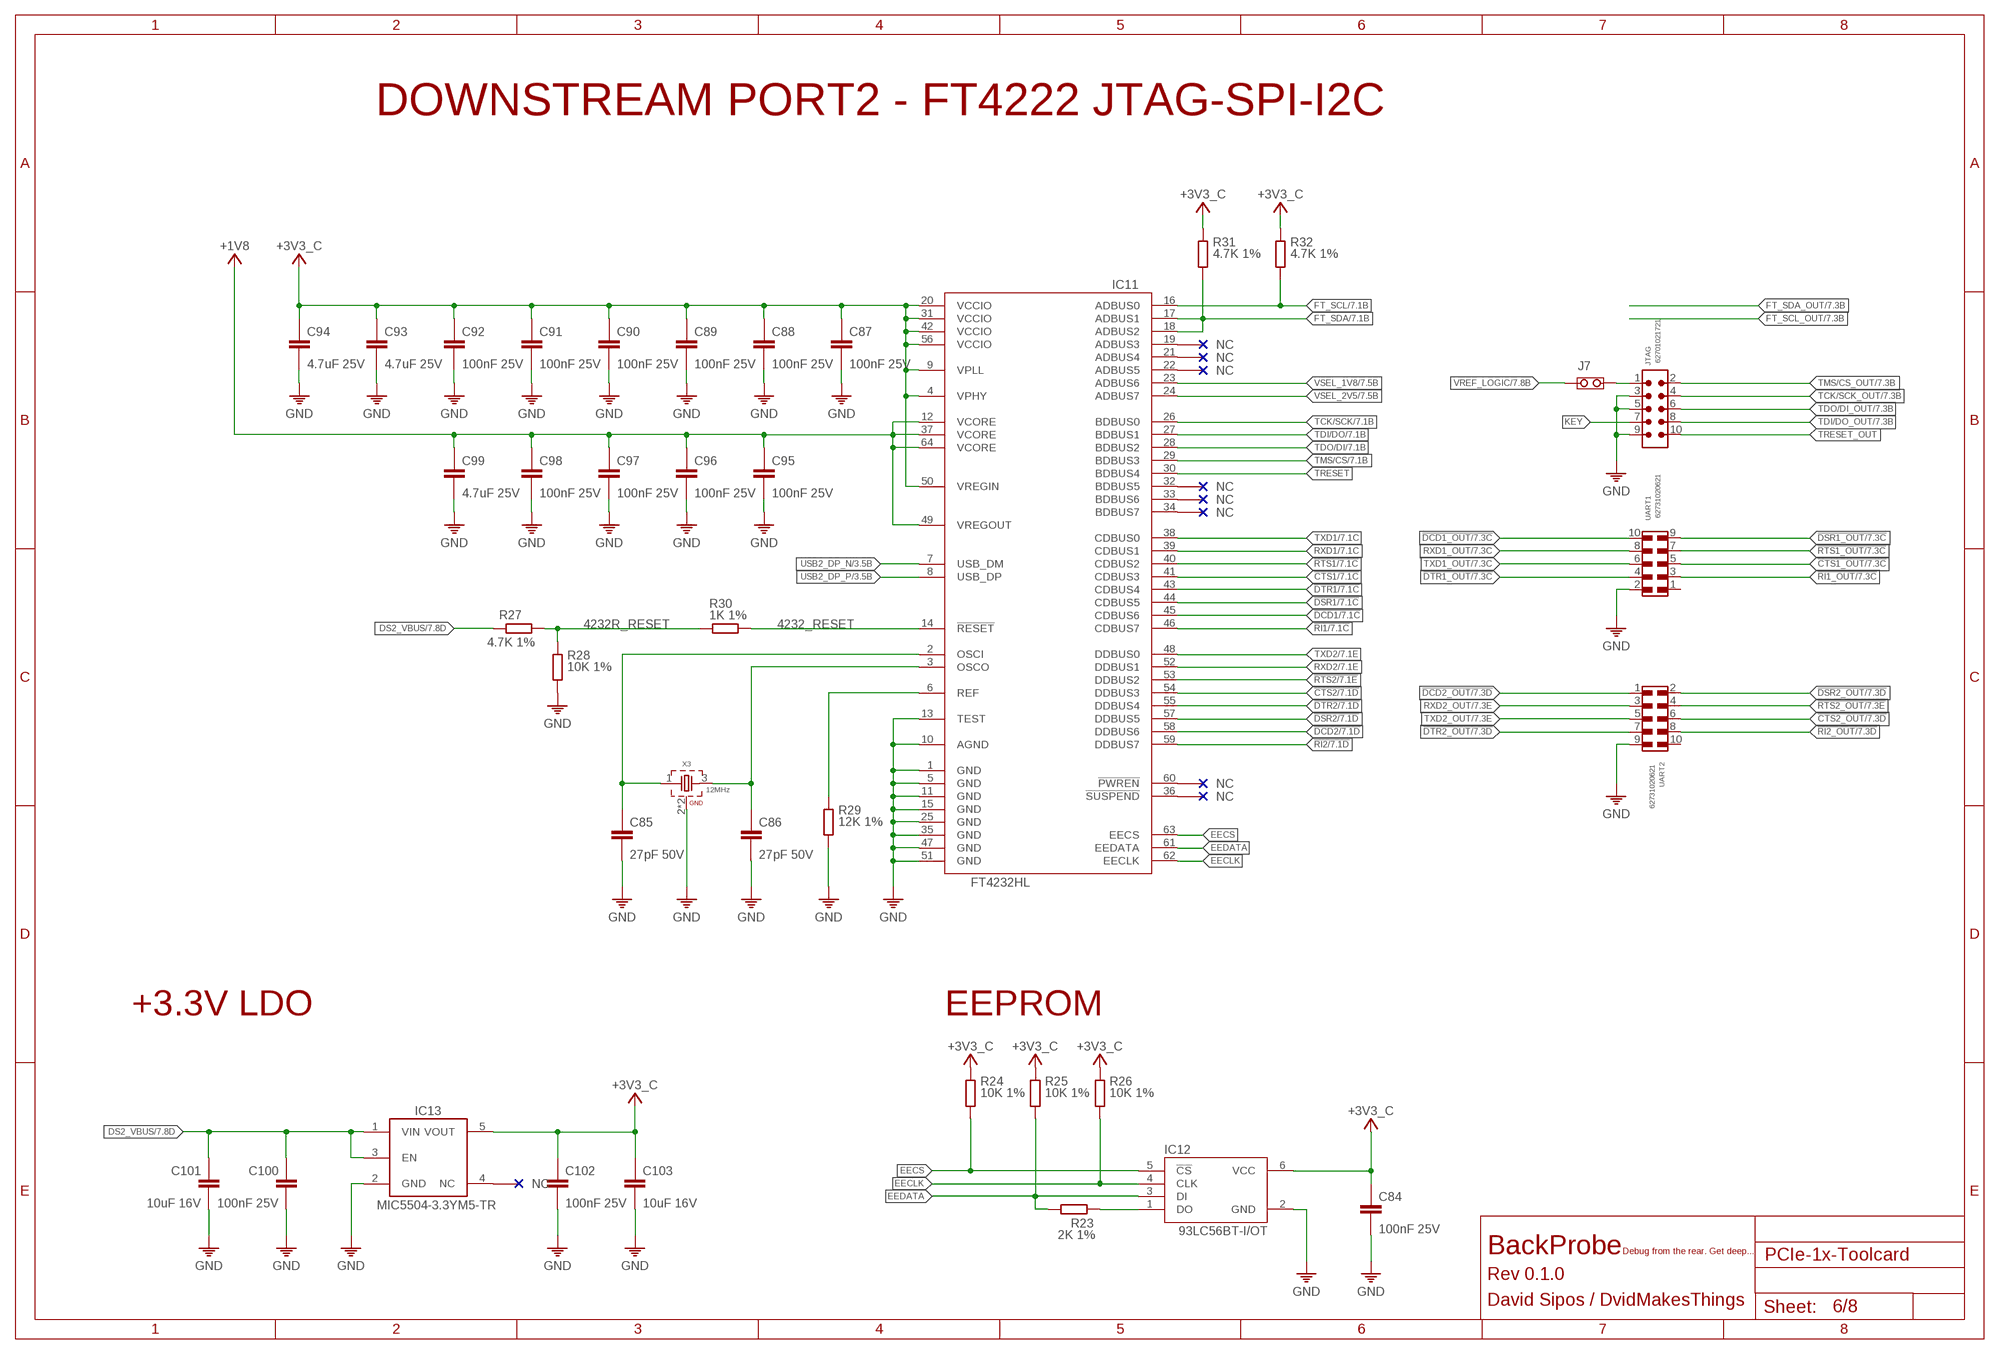
[diagram p5: schematic, sheet 6]

### Parts
C84  100nF 25V  100NF-25V-0402  [0402]
C85  27pF 50V  27PF-50V0201  [0201]
C86  27pF 50V  27PF-50V0201  [0201]
C87  100nF 25V  100NF-25V-0201  [0201]
C88  100nF 25V  100NF-25V-0201  [0201]
C89  100nF 25V  100NF-25V-0201  [0201]
C90  100nF 25V  100NF-25V-0201  [0201]
C91  100nF 25V  100NF-25V-0201  [0201]
C92  100nF 25V  100NF-25V-0201  [0201]
C93  4.7uF 25V  4.7UF-25V0402  [0402]
C94  4.7uF 25V  4.7UF-25V0402  [0402]
C95  100nF 25V  100NF-25V-0201  [0201]
C96  100nF 25V  100NF-25V-0201  [0201]
C97  100nF 25V  100NF-25V-0201  [0201]
C98  100nF 25V  100NF-25V-0201  [0201]
C99  4.7uF 25V  4.7UF-25V0402  [0402]
C100  100nF 25V  100NF-25V-0201  [0201]
C101  10uF 16V  10UF-16V-0603  [0603]
C102  100nF 25V  100NF-25V-0201  [0201]
C103  10uF 16V  10UF-16V-0603  [0603]
IC11  FT4232HL  [LQFP64-10X10]
IC12  93LC56BT-I/OT  [SOT95P280X145-6N]
IC13  MIC5504-3.3YM5  MIC5504-3.3YM5-TR  [SOT23-5]
J7  JUMPER-NO  [J-0402-NO]
JTAG  62701021721  6270XX21721_62701021721  [62701021721]
R23  2K 1%  2K-1%0201  [0201]
R24  10K 1%  10K-1%0201  [0201]
R25  10K 1%  10K-1%0201  [0201]
R26  10K 1%  10K-1%0201  [0201]
R27  4.7K 1%  4.7K-1%0201  [0201]
R28  10K 1%  10K-1%0201  [0201]
R29  12K 1%  12K-1%0201  [0201]
R30  1K 1%  1K-1%0201  [0201]
R31  4.7K 1%  4.7K-1%0201  [0201]
R32  4.7K 1%  4.7K-1%0201  [0201]
UART1  62731020621  6273XX20621_62731020621  [62731020621]
UART2  62731020621  6273XX20621_62731020621  [62731020621]
X3  12MHz  WE-XTAL_CFPX-180_830055295  [WE-XTAL_CFPX-180]

### Nets
4232_RESET: IC11.14(!RESET) R30.2
4232R_RESET: R27.2 R28.1 R30.1
!CTS1: IC11.41(CDBUS3) ; also sheet 7
!CTS1_OUT: UART1.5 ; also sheet 7
!CTS2: IC11.54(DDBUS3) ; also sheet 7
!CTS2_OUT: UART2.6 ; also sheet 7
!DCD1: IC11.45(CDBUS6) ; also sheet 7
!DCD1_OUT: UART1.10 ; also sheet 7
!DCD2: IC11.58(DDBUS6) ; also sheet 7
!DCD2_OUT: UART2.1 ; also sheet 7
!DSR1: IC11.44(CDBUS5) ; also sheet 7
!DSR1_OUT: UART1.9 ; also sheet 7
!DSR2: IC11.57(DDBUS5) ; also sheet 7
!DSR2_OUT: UART2.2 ; also sheet 7
!DTR1: IC11.43(CDBUS4) ; also sheet 7
!DTR1_OUT: UART1.4 ; also sheet 7
!DTR2: IC11.55(DDBUS4) ; also sheet 7
!DTR2_OUT: UART2.7 ; also sheet 7
!RI1: IC11.46(CDBUS7) ; also sheet 7
!RI1_OUT: UART1.3 ; also sheet 7
!RI2: IC11.59(DDBUS7) ; also sheet 7
!RI2_OUT: UART2.8 ; also sheet 7
!RTS1: IC11.40(CDBUS2) ; also sheet 7
!RTS1_OUT: UART1.7 ; also sheet 7
!RTS2: IC11.53(DDBUS2) ; also sheet 7
!RTS2_OUT: UART2.4 ; also sheet 7
+1V8: C95.1 C96.1 C97.1 C98.1 C99.1 IC11.12(VCORE) IC11.37(VCORE) IC11.49(VREGOUT) IC11.64(VCORE)
+3V3C: C84.1 C87.1 C88.1 C89.1 C90.1 C91.1 C92.1 C93.1 C94.1 C102.1 C103.1 IC11.4(VPHY) IC11.9(VPLL) IC11.20(VCCIO) IC11.31(VCCIO) IC11.42(VCCIO) IC11.50(VREGIN) IC11.56(VCCIO) IC12.6(VCC) IC13.5(VOUT) R24.1 R25.1 R26.1 R31.1 R32.1 ; supply symbol labelled +3V3_C ; also sheet 7
DS2_VBUS: C100.1 C101.1 IC13.1(VIN) IC13.3(EN) R27.1 ; also sheet 4,7
EECLK: IC11.62(EECLK) IC12.4(CLK) R26.2
EECS: IC11.63(EECS) IC12.5(!CS) R24.2
EEDATA: IC11.61(EEDATA) IC12.3(DI) R23.2 R25.2
FT_SCL: IC11.16(ADBUS0) R32.2 ; also sheet 7
FT_SDA: IC11.17(ADBUS1) IC11.18(ADBUS2) R31.2 ; also sheet 7
GND: C84.2 C85.2 C86.2 C87.2 C88.2 C89.2 C90.2 C91.2 C92.2 C93.2 C94.2 C95.2 C96.2 C97.2 C98.2 C99.2 C100.2 C101.2 C102.2 C103.2 IC11.1(GND) IC11.5(GND) IC11.10(AGND) IC11.11(GND) IC11.13(TEST) IC11.15(GND) IC11.25(GND) IC11.35(GND) IC11.47(GND) IC11.51(GND) IC12.2(GND) IC13.2(GND) JTAG.3 JTAG.5 JTAG.9 R28.2 R29.2 UART1.2 UART2.9 X3.2(GND) X3.4(GND) ; also sheet 1,2,3,4,5,7,8
KEY: JTAG.7
N$2: IC11.6(REF) R29.1
N$3: C85.1 IC11.2(OSCI) X3.1
N$6: IC12.1(DO) R23.1
N$10: C86.1 IC11.3(OSCO) X3.3
N$15: J7.2 JTAG.1
RXD1: IC11.39(CDBUS1) ; also sheet 7
RXD1_OUT: UART1.8 ; also sheet 7
RXD2: IC11.52(DDBUS1) ; also sheet 7
RXD2_OUT: UART2.3 ; also sheet 7
TCK/SCK: IC11.26(BDBUS0) ; also sheet 7
TCK/SCK_OUT: JTAG.4 ; also sheet 7
TDI/DO: IC11.27(BDBUS1) ; also sheet 7
TDI/DO_OUT: JTAG.8 ; also sheet 7
TDO/DI: IC11.28(BDBUS2) ; also sheet 7
TDO/DI_OUT: JTAG.6 ; also sheet 7
TMS/CS: IC11.29(BDBUS3) ; also sheet 7
TMS/CS_OUT: JTAG.2 ; also sheet 7
TRESET: IC11.30(BDBUS4)
TRESET_OUT: JTAG.10
TXD1: IC11.38(CDBUS0) ; also sheet 7
TXD1_OUT: UART1.6 ; also sheet 7
TXD2: IC11.48(DDBUS0) ; also sheet 7
TXD2_OUT: UART2.5 ; also sheet 7
USB2_DP_N [90R_DE]: IC11.7(USB_DM) ; also sheet 3
USB2_DP_P [90R_DE]: IC11.8(USB_DP) ; also sheet 3
VREF_LOGIC: J7.1 ; also sheet 7
VSEL_1V8: IC11.23(ADBUS6) ; also sheet 7
VSEL_2V5: IC11.24(ADBUS7) ; also sheet 7
Unconnected: IC11.19(ADBUS3) IC11.21(ADBUS4) IC11.22(ADBUS5) IC11.32(BDBUS5) IC11.33(BDBUS6) IC11.34(BDBUS7) IC11.36(!SUSPEND) IC11.60(!PWREN) IC13.4(NC) UART1.1 UART2.10

### Notes on the sheet
- DOWNSTREAM PORT2 - FT4222 JTAG-SPI-I2C
- +3.3V LDO | EEPROM
- BackProbe | Debug from the rear. Get deep...
- Rev 0.1.0
- David Sipos / DvidMakesThings

## Sheet 7 of 8: Downstream port 2/2
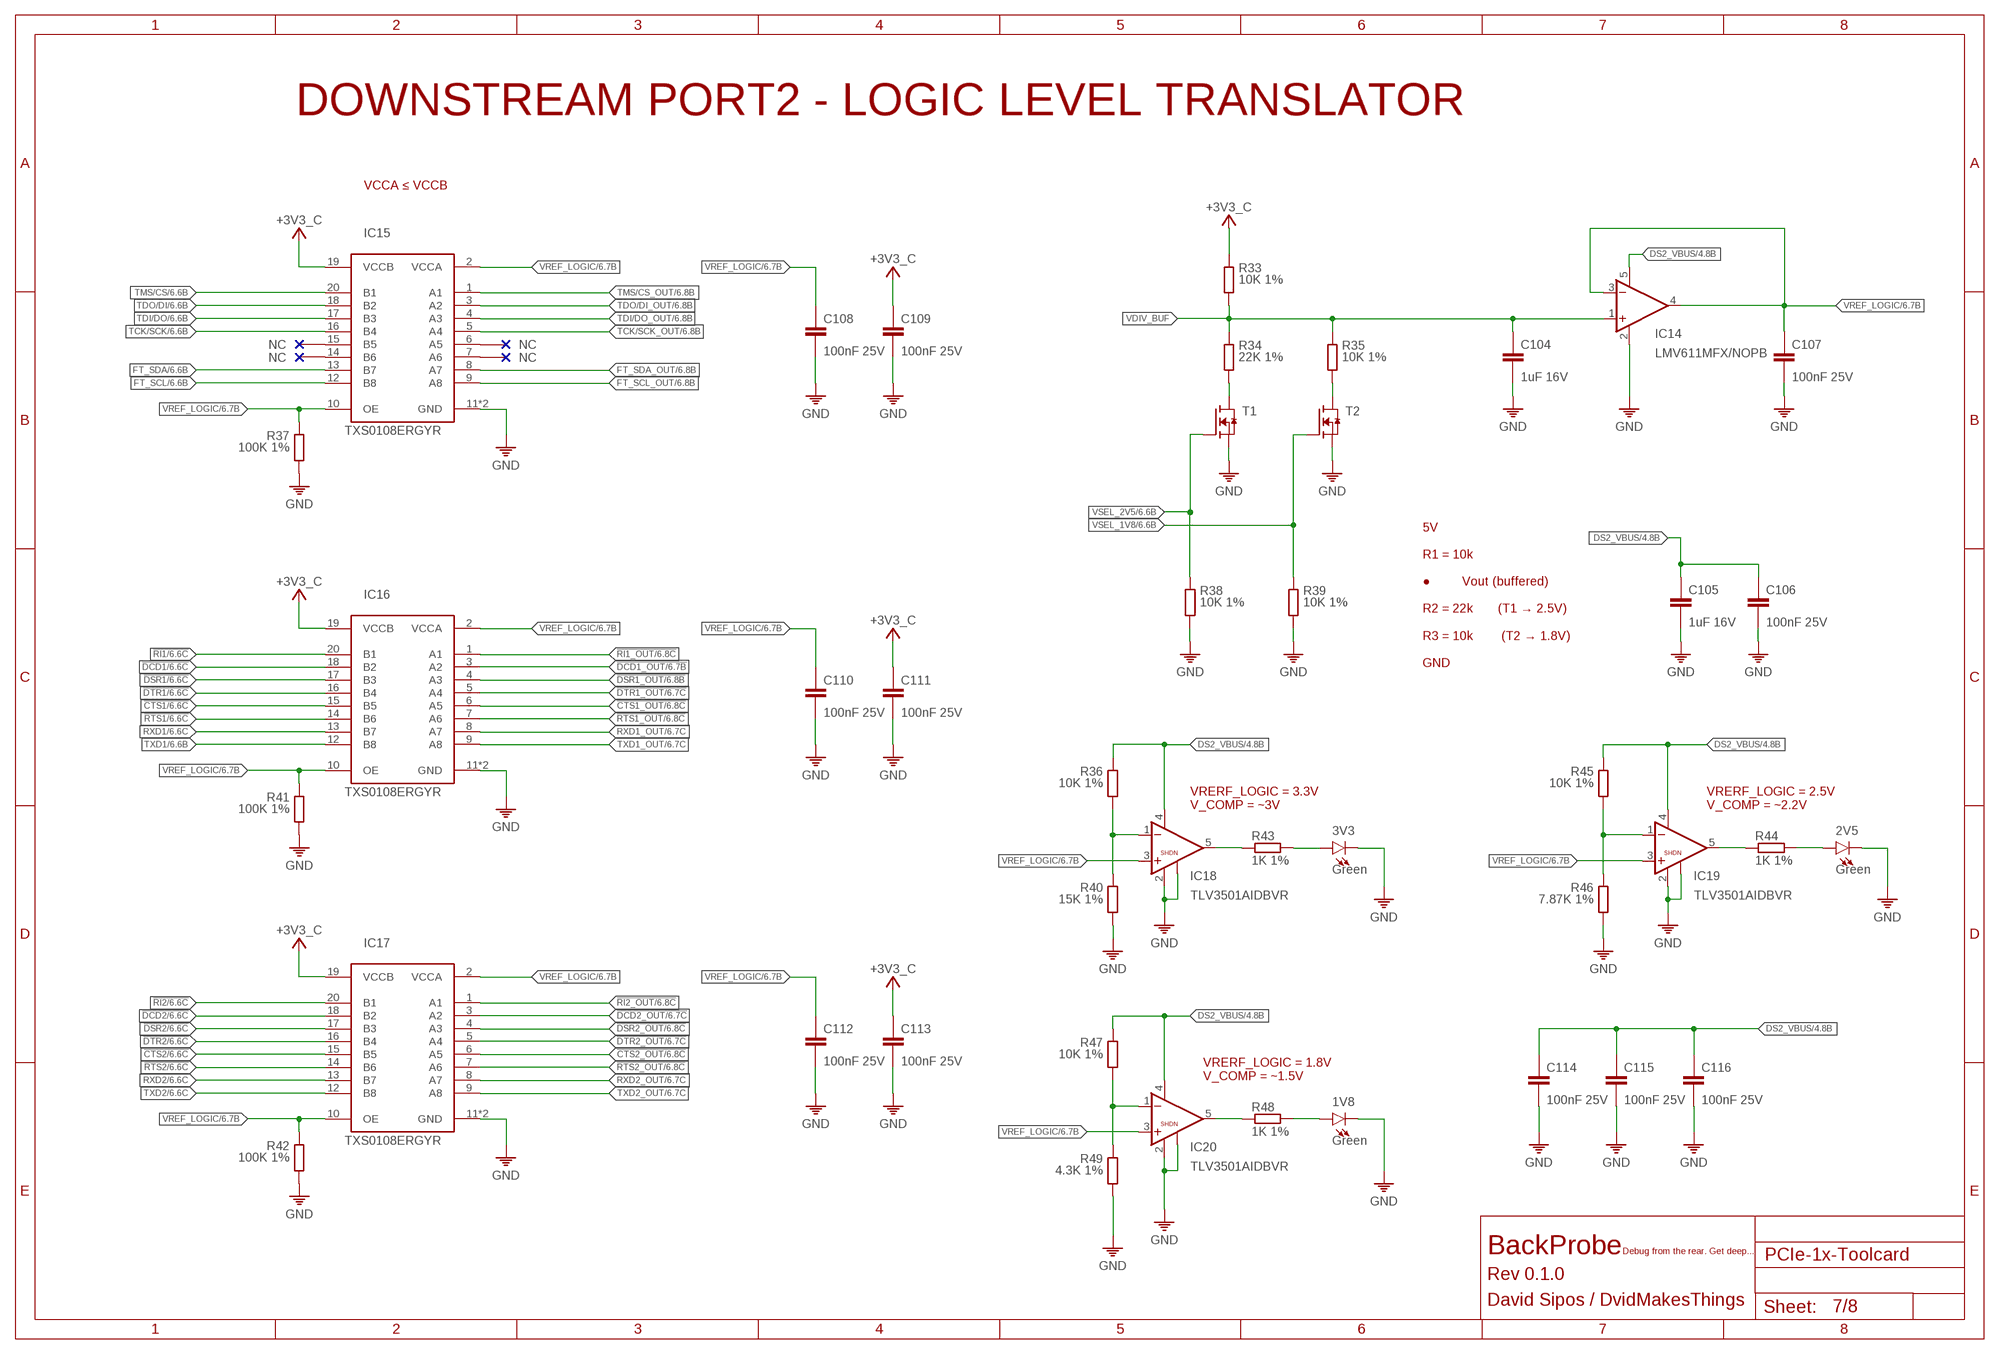
[diagram p6: schematic, sheet 7]

### Parts
1V8  Green  LED-GREENLED-0603  [LED-0603]
2V5  Green  LED-GREENLED-0603  [LED-0603]
3V3  Green  LED-GREENLED-0603  [LED-0603]
C104  1uF 16V  1UF-16V0201  [0201]
C105  1uF 16V  1UF-16V0201  [0201]
C106  100nF 25V  100NF-25V-0201  [0201]
C107  100nF 25V  100NF-25V-0201  [0201]
C108  100nF 25V  100NF-25V-0201  [0201]
C109  100nF 25V  100NF-25V-0201  [0201]
C110  100nF 25V  100NF-25V-0201  [0201]
C111  100nF 25V  100NF-25V-0201  [0201]
C112  100nF 25V  100NF-25V-0201  [0201]
C113  100nF 25V  100NF-25V-0201  [0201]
C114  100nF 25V  100NF-25V-0201  [0201]
C115  100nF 25V  100NF-25V-0201  [0201]
C116  100nF 25V  100NF-25V-0201  [0201]
IC14  LMV611MFX/NOPB  LMV611MFX  [SOT23-5]
IC15  TXS0108ERGYR  TXB0108RGY  [VQFN24]
IC16  TXS0108ERGYR  TXB0108RGY  [VQFN24]
IC17  TXS0108ERGYR  TXB0108RGY  [VQFN24]
IC18  TLV3501AIDBVR  TLV3501AIDB  [SOT95P280X145-6N]
IC19  TLV3501AIDBVR  TLV3501AIDB  [SOT95P280X145-6N]
IC20  TLV3501AIDBVR  TLV3501AIDB  [SOT95P280X145-6N]
R33  10K 1%  10K-1%0402  [0402]
R34  22K 1%  22K-1%0402  [0402]
R35  10K 1%  10K-1%0402  [0402]
R36  10K 1%  10K-1%0201  [0201]
R37  100K 1%  100K-1%0201  [0201]
R38  10K 1%  10K-1%0402  [0402]
R39  10K 1%  10K-1%0402  [0402]
R40  15K 1%  15K-1%0201  [0201]
R41  100K 1%  100K-1%0201  [0201]
R42  100K 1%  100K-1%0201  [0201]
R43  1K 1%  1K-1%0603  [0603]
R44  1K 1%  1K-1%0603  [0603]
R45  10K 1%  10K-1%0201  [0201]
R46  7.87K 1%  7.87K-1%0201  [0201]
R47  10K 1%  10K-1%0201  [0201]
R48  1K 1%  1K-1%0603  [0603]
R49  4.3K 1%  4.3K-1%0201  [0201]
T1  BSS138  [SOT23]
T2  BSS138  [SOT23]

### Nets
!CTS1: IC16.15(B5) ; also sheet 6
!CTS1_OUT: IC16.6(A5) ; also sheet 6
!CTS2: IC17.15(B5) ; also sheet 6
!CTS2_OUT: IC17.6(A5) ; also sheet 6
!DCD1: IC16.18(B2) ; also sheet 6
!DCD1_OUT: IC16.3(A2) ; also sheet 6
!DCD2: IC17.18(B2) ; also sheet 6
!DCD2_OUT: IC17.3(A2) ; also sheet 6
!DSR1: IC16.17(B3) ; also sheet 6
!DSR1_OUT: IC16.4(A3) ; also sheet 6
!DSR2: IC17.17(B3) ; also sheet 6
!DSR2_OUT: IC17.4(A3) ; also sheet 6
!DTR1: IC16.16(B4) ; also sheet 6
!DTR1_OUT: IC16.5(A4) ; also sheet 6
!DTR2: IC17.16(B4) ; also sheet 6
!DTR2_OUT: IC17.5(A4) ; also sheet 6
!RI1: IC16.20(B1) ; also sheet 6
!RI1_OUT: IC16.1(A1) ; also sheet 6
!RI2: IC17.20(B1) ; also sheet 6
!RI2_OUT: IC17.1(A1) ; also sheet 6
!RTS1: IC16.14(B6) ; also sheet 6
!RTS1_OUT: IC16.7(A6) ; also sheet 6
!RTS2: IC17.14(B6) ; also sheet 6
!RTS2_OUT: IC17.7(A6) ; also sheet 6
+3V3C: C109.1 C111.1 C113.1 IC15.19(VCCB) IC16.19(VCCB) IC17.19(VCCB) R33.1 ; supply symbol labelled +3V3_C ; also sheet 6
COMP18_O: IC20.5(OUT) R48.1
COMP25_O: IC19.5(OUT) R44.1
COMP33_O: IC18.5(OUT) R43.1
D25: R35.2 T2.3(D)
D33: R34.2 T1.3(D)
DS2_VBUS: C105.1 C106.1 C114.1 C115.1 C116.1 IC14.5(V+) IC18.4(V+) IC19.4(V+) IC20.4(V+) R36.1 R45.1 R47.1 ; also sheet 4,6
FT_SCL: IC15.12(B8) ; also sheet 6
FT_SCL_OUT: IC15.9(A8) ; also sheet 6
FT_SDA: IC15.13(B7) ; also sheet 6
FT_SDA_OUT: IC15.8(A7) ; also sheet 6
GND: 1V8.C 2V5.C 3V3.C C104.2 C105.2 C106.2 C107.2 C108.2 C109.2 C110.2 C111.2 C112.2 C113.2 C114.2 C115.2 C116.2 IC14.2(V-) IC15.11(GND) IC15.PAD(GND) IC16.11(GND) IC16.PAD(GND) IC17.11(GND) IC17.PAD(GND) IC18.2(V-) IC18.6(SHDN) IC19.2(V-) IC19.6(SHDN) IC20.2(V-) IC20.6(SHDN) R37.2 R38.2 R39.2 R40.2 R41.2 R42.2 R46.2 R49.2 T1.2(S) T2.2(S) ; also sheet 1,2,3,4,5,6,8
N$8: 3V3.A R43.2
N$12: 2V5.A R44.2
N$14: 1V8.A R48.2
RXD1: IC16.13(B7) ; also sheet 6
RXD1_OUT: IC16.8(A7) ; also sheet 6
RXD2: IC17.13(B7) ; also sheet 6
RXD2_OUT: IC17.8(A7) ; also sheet 6
TCK/SCK: IC15.16(B4) ; also sheet 6
TCK/SCK_OUT: IC15.5(A4) ; also sheet 6
TDI/DO: IC15.17(B3) ; also sheet 6
TDI/DO_OUT: IC15.4(A3) ; also sheet 6
TDO/DI: IC15.18(B2) ; also sheet 6
TDO/DI_OUT: IC15.3(A2) ; also sheet 6
TMS/CS: IC15.20(B1) ; also sheet 6
TMS/CS_OUT: IC15.1(A1) ; also sheet 6
TXD1: IC16.12(B8) ; also sheet 6
TXD1_OUT: IC16.9(A8) ; also sheet 6
TXD2: IC17.12(B8) ; also sheet 6
TXD2_OUT: IC17.9(A8) ; also sheet 6
V_COMP18: IC20.1(-IN) R47.2 R49.1
V_COMP25: IC19.1(-IN) R45.2 R46.1
V_COMP33: IC18.1(-IN) R36.2 R40.1
VDIV_BUF: C104.1 IC14.1(+IN) R33.2 R34.1 R35.1
VREF_LOGIC: C107.1 C108.1 C110.1 C112.1 IC14.3(-IN) IC14.4(OUT) IC15.2(VCCA) IC15.10(OE) IC16.2(VCCA) IC16.10(OE) IC17.2(VCCA) IC17.10(OE) IC18.3(+IN) IC19.3(+IN) IC20.3(+IN) R37.1 R41.1 R42.1 ; also sheet 6
VSEL_1V8: R39.1 T2.1(G) ; also sheet 6
VSEL_2V5: R38.1 T1.1(G) ; also sheet 6
Unconnected: IC15.6(A5) IC15.7(A6) IC15.14(B6) IC15.15(B5)

### Notes on the sheet
- DOWNSTREAM PORT2 - LOGIC LEVEL TRANSLATOR
- VCCA ≤ VCCB
- 5V
  │
  R1 = 10k
  │
  ●─── Vout (buffered)
  │
  R2 = 22k       (T1 → 2.5V)
  │
  R3 = 10k        (T2 → 1.8V)
  │
  GND
- VRERF_LOGIC = 3.3V
  V_COMP = ~3V
- VRERF_LOGIC = 2.5V
  V_COMP = ~2.2V
- VRERF_LOGIC = 1.8V
  V_COMP = ~1.5V
- BackProbe | Debug from the rear. Get deep...
- Rev 0.1.0
- David Sipos / DvidMakesThings

## Sheet 8 of 8: Downstream port 3
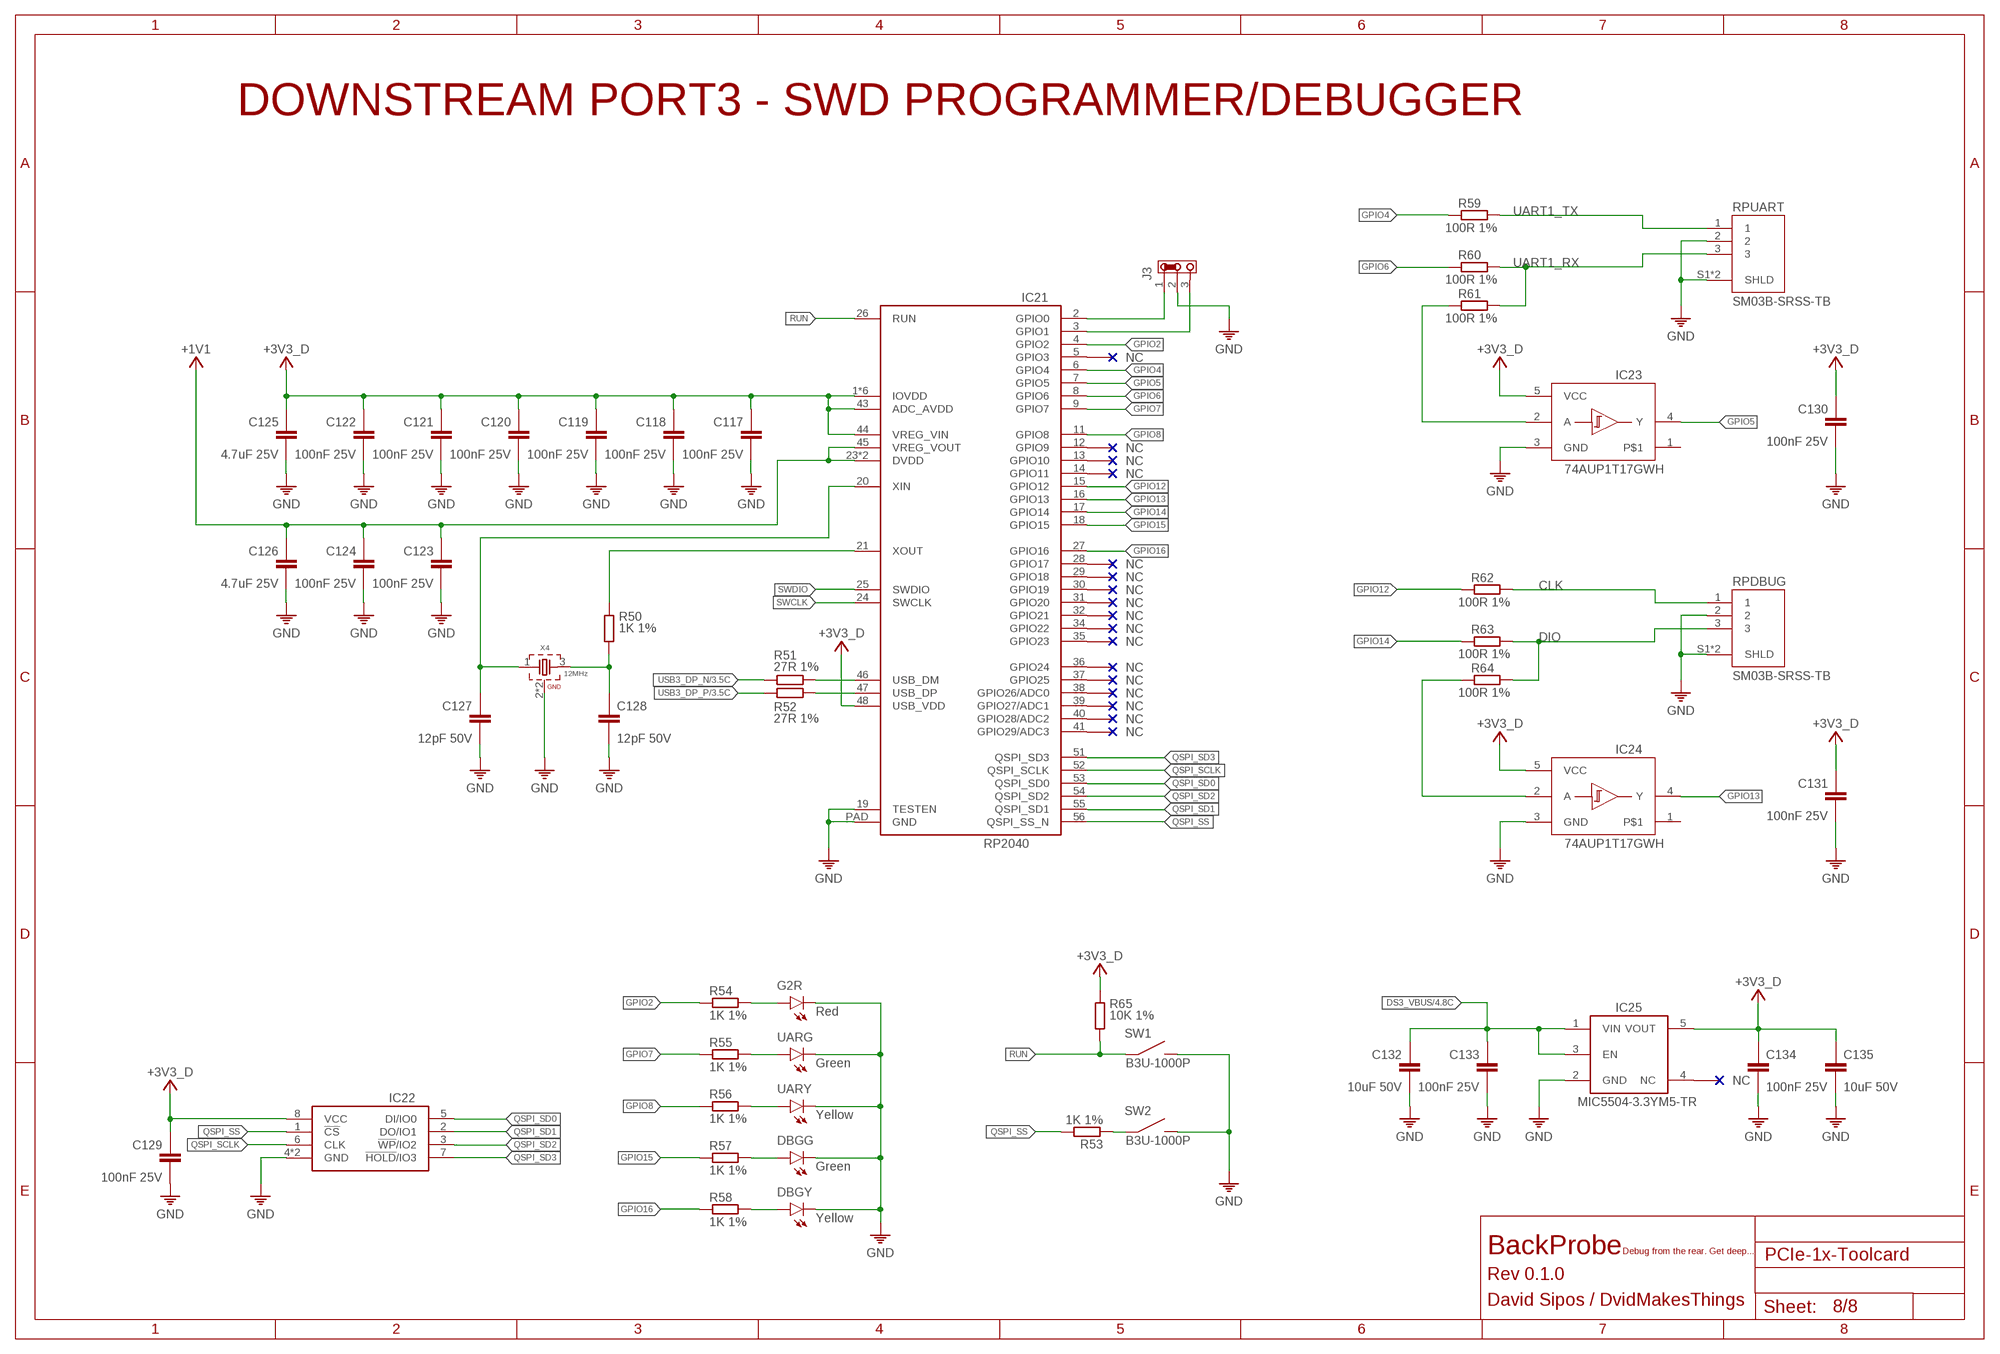
[diagram p7: schematic, sheet 8]

### Parts
C117  100nF 25V  100NF-25V-0201  [0201]
C118  100nF 25V  100NF-25V-0201  [0201]
C119  100nF 25V  100NF-25V-0201  [0201]
C120  100nF 25V  100NF-25V-0201  [0201]
C121  100nF 25V  100NF-25V-0201  [0201]
C122  100nF 25V  100NF-25V-0201  [0201]
C123  100nF 25V  100NF-25V-0201  [0201]
C124  100nF 25V  100NF-25V-0201  [0201]
C125  4.7uF 25V  4.7UF-25V0402  [0402]
C126  4.7uF 25V  4.7UF-25V0402  [0402]
C127  12pF 50V  12PF-50V0201  [0201]
C128  12pF 50V  12PF-50V0201  [0201]
C129  100nF 25V  100NF-25V-0201  [0201]
C130  100nF 25V  100NF-25V-0201  [0201]
C131  100nF 25V  100NF-25V-0201  [0201]
C132  10uF 50V  10UF-50V-0805  [0805]
C133  100nF 25V  100NF-25V-0201  [0201]
C134  100nF 25V  100NF-25V-0201  [0201]
C135  10uF 50V  10UF-50V-0805  [0805]
DBGG  Green  LED-GREENLED-0603  [LED-0603]
DBGY  Yellow  LED-YELLOWLED-0603  [LED-0603]
G2R  Red  LED-REDLED-0603  [LED-0603]
IC21  RP2040  [QFN56]
IC22  W25Q128JVP  [SON127P600X500X75-8N]
IC23  74AUP1T17GWH  74AUP1T17GW  [SOT353-1]
IC24  74AUP1T17GWH  74AUP1T17GW  [SOT353-1]
IC25  MIC5504-3.3YM5  MIC5504-3.3YM5-TR  [SOT23-5]
J3  JUMPER-3  [JUMPER-3]
R50  1K 1%  1K-1%0201  [0201]
R51  27R 1%  27R-1%0201  [0201]
R52  27R 1%  27R-1%0201  [0201]
R53  1K 1%  1K-1%0201  [0201]
R54  1K 1%  1K-1%0402  [0402]
R55  1K 1%  1K-1%0402  [0402]
R56  1K 1%  1K-1%0402  [0402]
R57  1K 1%  1K-1%0402  [0402]
R58  1K 1%  1K-1%0402  [0402]
R59  100R 1%  100R-1%0201  [0201]
R60  100R 1%  100R-1%0201  [0201]
R61  100R 1%  100R-1%0201  [0201]
R62  100R 1%  100R-1%0201  [0201]
R63  100R 1%  100R-1%0201  [0201]
R64  100R 1%  100R-1%0201  [0201]
R65  10K 1%  10K-1%0201  [0201]
RPDBUG  SM03B-SRSS-TB  [SM03B-SRSS-TB]
RPUART  SM03B-SRSS-TB  [SM03B-SRSS-TB]
SW1  B3U-1000P  B3U-1000P  [B3U-1000P]
SW2  B3U-1000P  B3U-1000P  [B3U-1000P]
UARG  Green  LED-GREENLED-0603  [LED-0603]
UARY  Yellow  LED-YELLOWLED-0603  [LED-0603]
X4  12MHz  WE-XTAL_CFPX-180_830055295  [WE-XTAL_CFPX-180]

### Nets
+1V1: C123.1 C124.1 C126.1 IC21.23(DVDD) IC21.45(VREG_VOUT) IC21.50(DVDD)
+3V3D: C117.1 C118.1 C119.1 C120.1 C121.1 C122.1 C125.1 C129.1 C130.1 C131.1 C134.1 C135.1 IC21.1(IOVDD) IC21.10(IOVDD) IC21.22(IOVDD) IC21.33(IOVDD) IC21.42(IOVDD) IC21.43(ADC_AVDD) IC21.44(VREG_VIN) IC21.48(USB_VDD) IC21.49(IOVDD) IC22.8(VCC) IC23.5(VCC) IC24.5(VCC) IC25.5(VOUT) R65.1 ; supply symbol labelled +3V3_D
BOOT: R53.1 SW2.1
CLK: R62.2 RPDBUG.1
DIO: R63.2 R64.2 RPDBUG.3
DS3_VBUS: C132.1 C133.1 IC25.1(VIN) IC25.3(EN) ; also sheet 4
GND: C117.2 C118.2 C119.2 C120.2 C121.2 C122.2 C123.2 C124.2 C125.2 C126.2 C127.2 C128.2 C129.2 C130.2 C131.2 C132.2 C133.2 C134.2 C135.2 DBGG.C DBGY.C G2R.C IC21.19(TESTEN) IC21.PAD(GND) IC22.4(GND) IC22.PAD(GND) IC23.3(GND) IC24.3(GND) IC25.2(GND) J3.2 RPDBUG.2 RPDBUG.S1(SHLD) RPDBUG.S2(SHLD) RPUART.2 RPUART.S1(SHLD) RPUART.S2(SHLD) SW1.2 SW2.2 UARG.C UARY.C X4.2(GND) X4.4(GND) ; also sheet 1,2,3,4,5,6,7
GPIO2: IC21.4(GPIO2) R54.1
GPIO4: IC21.6(GPIO4) R59.1
GPIO5: IC21.7(GPIO5) IC23.4(Y)
GPIO6: IC21.8(GPIO6) R60.1
GPIO7: IC21.9(GPIO7) R55.1
GPIO8: IC21.11(GPIO8) R56.1
GPIO12: IC21.15(GPIO12) R62.1
GPIO13: IC21.16(GPIO13) IC24.4(Y)
GPIO14: IC21.17(GPIO14) R63.1
GPIO15: IC21.18(GPIO15) R57.1
GPIO16: IC21.27(GPIO16) R58.1
N$1: IC21.2(GPIO0) J3.1
N$7: IC21.3(GPIO1) J3.3
N$9: C127.1 IC21.20(XIN) X4.1
N$11: C128.1 R50.2 X4.3
N$13: IC21.21(XOUT) R50.1
N$16: G2R.A R54.2
N$17: DBGG.A R57.2
N$18: DBGY.A R58.2
N$19: R56.2 UARY.A
N$20: R55.2 UARG.A
N$21: IC24.2(A) R64.1
N$24: IC23.2(A) R61.1
QSPI_SCLK: IC21.52(QSPI_SCLK) IC22.6(CLK)
QSPI_SD0: IC21.53(QSPI_SD0) IC22.5(DI/IO0)
QSPI_SD1: IC21.55(QSPI_SD1) IC22.2(DO/IO1)
QSPI_SD2: IC21.54(QSPI_SD2) IC22.3(!WP!/IO2)
QSPI_SD3: IC21.51(QSPI_SD3) IC22.7(!HOLD!/IO3)
QSPI_SS: IC21.56(QSPI_SS_N) IC22.1(!CS) R53.2
RUN: IC21.26(RUN) R65.2 SW1.1
SWCLK: IC21.24(SWCLK)
SWDIO: IC21.25(SWDIO)
UART1_RX: R60.2 R61.2 RPUART.3
UART1_TX: R59.2 RPUART.1
USB3_DP_N [90R_DE]: R51.1 ; also sheet 3
USB3_DP_P [90R_DE]: R52.2 ; also sheet 3
USB_PID_N [90R_DE]: IC21.46(USB_DM) R51.2
USB_PID_P [90R_DE]: IC21.47(USB_DP) R52.1
Unconnected: IC21.5(GPIO3) IC21.12(GPIO9) IC21.13(GPIO10) IC21.14(GPIO11) IC21.28(GPIO17) IC21.29(GPIO18) IC21.30(GPIO19) IC21.31(GPIO20) IC21.32(GPIO21) IC21.34(GPIO22) IC21.35(GPIO23) IC21.36(GPIO24) IC21.37(GPIO25) IC21.38(GPIO26/ADC0) IC21.39(GPIO27/ADC1) IC21.40(GPIO28/ADC2) IC21.41(GPIO29/ADC3) IC23.1 IC24.1 IC25.4(NC)

### Notes on the sheet
- DOWNSTREAM PORT3 - SWD PROGRAMMER/DEBUGGER
- BackProbe | Debug from the rear. Get deep...
- Rev 0.1.0
- David Sipos / DvidMakesThings

## Library data of the parts
1V8 2V5 3V3 DBGG PGOOD3 PGOOD5 UARG = ds_LED:LED-GREEN; DESCRIPTION: 20mA 810mcd Colorless and transparent Individual diode 515nm~535nm -20℃~+85℃ Positive Stick Emerald 120° 70mW 3.3V 0603 LED Indication - Discrete ROHS; LCSC_PART: C965804
!PERST !REQ !RST !SMI AUX3 = testpad:TP: Test pad
C1-C5 C13-C16 C84 = ds_capacitors:100NF-25V; DESCRIPTION: 25V 100nF X7R ±10% 0402 Multilayer Ceramic Capacitors MLCC - SMD/SMT ROHS; LCSC_PART: C56392
C6 C9 C11 C12 C80 C81 C132 C135 = ds_capacitors:10UF-50V; DESCRIPTION: 50V 10uF X5R ±10% 0805 Multilayer Ceramic Capacitors MLCC - SMD/SMT ROHS; LCSC_PART: C440198
C7 C8 C23 C25 C27 C29 C31 C33 C40 C41 C54-C58 C61 C62 = ds_capacitors:100NF-16V; DESCRIPTION: 16V 100nF X5R ±10% 0201 Multilayer Ceramic Capacitors MLCC - SMD/SMT ROHS; LCSC_PART: C2846674
C10 = ds_passive:C
C17-C22 C24 C26 C28 C30 C32 C34-C39 C48 = ds_capacitors:10NF-16V; DESCRIPTION: 16V 10nF X7R ±10% 0201 Multilayer Ceramic Capacitors MLCC - SMD/SMT ROHS; LCSC_PART: C272853
C42 C65 C104 C105 = ds_capacitors:1UF-16V; DESCRIPTION: 16V 1uF X5R ±20% 0201 Multilayer Ceramic Capacitors MLCC - SMD/SMT ROHS; LCSC_PART: C307385
C43 C44 = ds_capacitors:8PF-50V; DESCRIPTION: 50V 8pF CH 0201 Multilayer Ceramic Capacitors MLCC - SMD/SMT ROHS; LCSC_PART: C161366
C45 = ds_capacitors:22UF-25V; DESCRIPTION: 25V 22uF X5R ±20% 0805 Multilayer Ceramic Capacitors MLCC - SMD/SMT ROHS; LCSC_PART: C45783
C46 = ds_capacitors:10UF-16V; DESCRIPTION: 16V 10uF X5R ±10% 0805 Multilayer Ceramic Capacitors MLCC - SMD/SMT ROHS; LCSC_PART: C1713
C47 C51 = ds_capacitors:10NF-50V; DESCRIPTION: 50V 10nF X7R ±10% 0805 Multilayer Ceramic Capacitors MLCC - SMD/SMT ROHS; LCSC_PART: C1710
C49 = ds_capacitors:C
C50 = ds_capacitors:10NF-25V; DESCRIPTION: 25V 10nF X7R ±10% 0402 Multilayer Ceramic Capacitors MLCC - SMD/SMT ROHS; LCSC_PART: C284987
C52 = ds_capacitors:330UF-25V; DESCRIPTION: 330uF 25V ±20% SMD,D6.3xL7.7mm Aluminum Electrolytic Capacitors - SMD ROHS; LCSC_PART: C2980171
C53 = ds_capacitors:22UF-16V; DESCRIPTION: 16V 22uF X5R ±10% 0805 Multilayer Ceramic Capacitors MLCC - SMD/SMT ROHS; LCSC_PART: C76637
C59 C60 C63 C64 = ds_capacitors:150UF-35V; DESCRIPTION: 150uF 35V 118mA@120Hz ±20% SMD,D6.3xL7.7mm Aluminum Electrolytic Capacitors - SMD ROHS; LCSC_PART: C3032176
C66-C74 C77-C79 C82 C83 C87-C92 C95-C98 C100 C102 C106-C124 C129-C131 C133 C134 = ds_capacitors:100NF-25V; DESCRIPTION: 25V 100nF X5R ±10% 0201 Multilayer Ceramic Capacitors MLCC - SMD/SMT ROHS; LCSC_PART: C76939
C75 C76 C127 C128 = ds_capacitors:12PF-50V; DESCRIPTION: 50V 12pF C0G ±5% 0201 Multilayer Ceramic Capacitors MLCC - SMD/SMT ROHS; LCSC_PART: C50391
C85 C86 = ds_capacitors:27PF-50V; DESCRIPTION: 50V 27pF C0G ±5% 0201 Multilayer Ceramic Capacitors MLCC - SMD/SMT ROHS; LCSC_PART: C85899
C93 C94 C99 C125 C126 = ds_capacitors:4.7UF-25V; DESCRIPTION: 25V 4.7uF X5R ±20% 0402 Multilayer Ceramic Capacitors MLCC - SMD/SMT ROHS; LCSC_PART: C22367824
C101 C103 = ds_capacitors:10UF-16V; DESCRIPTION: 16V 10uF X5R ±20% 0603 Multilayer Ceramic Capacitors MLCC - SMD/SMT ROHS; LCSC_PART: C92487
D1 = diode:BAT54: Schottky Diodes Source: Fairchild .. BAT54.pdf
D8 = adafruit:DIODE: Diode SMADIODE - SMA Surface Mount Package 20V 1A Schottky Diode Digikey: 641-1014-6-ND DO-1N4148 - Through Hole Small Current Diode SOD-123 20V 1 A (.5mV Vf) Schottky Diode - Digikey: MBRX120TPMSCT-ND SOD-323 10V 570mA (.38mV Vf, 3ns) Schottky Diode - Digikey: ZLLS410CT-ND SOD-523 30V 30mA Schottky Diode (RB751S-40TE61) - Digikey: RB751S-40TE61CT-ND SOT23-R/W - SOT23 Package (R = Solder Paste/Reflow Ovens, W = Hand-Soldering) BAT54Film 40V 300mA - Digikey: 497-7162-1-ND
D9 = diode:DIODE-: DIODE
D10 G2R PORT1-PORT4 = ds_LED:LED-RED; DESCRIPTION: -40℃~+85℃ Red 0603 LED Indication - Discrete ROHS; LCSC_PART: C2286
DBGY UARY = ds_LED:LED-YELLOW; DESCRIPTION: 20mA Colorless Transparent Lens -40℃~+85℃ 585.5nm~591.5nm Yellow 120° 60mW 0603 LED Indication - Discrete ROHS; LCSC_PART: C72038
IC1 = ds_ic_peripherals:UPD720201: The µPD720201 and µPD720202 are Renesas’ third generation Universal Serial Bus 3.0 host controllers, which comply with Universal Serial Bus 3.0 Specification, and Intel’s eXtensible Host Controller Interface (xHCI). These devices reduce power consumption and offer a smaller package foot-print making them ideal for designers who wish to add the USB3.0 interface to mobile computing devices such as laptops and notebook computers. The µPD720201 supports up to four USB3.0 SuperSpeed ports and the µPD720202 supports up to two USB3.0 SuperSpeed ports. The µPD720201 and µPD720202 use a PCI Express® Gen 2 system interface bus allowing system designers to easily add up to four (µPD720201) or two (µPD720202) USB3.0 SuperSpeed ports to systems containing the PCI Express bus interface. When connected to USB 3.0- compliant peripherals, the µPD720201 and µPD720202 can transfer information at clock speeds of up to 5 Gbps. The µPD720201 and µPD720202 and USB3.0 standard are fully compliant and backward compatible with the previous USB2.0 standard. The new USB3.0 standard supports data transfer speeds of up to ten times faster than those of the previous-generation USB2.0 standard, enabling quick and efficient transfers of large amounts of information.; DATASHEET: https://www.renesas.com/us/en/document/dst/upd720201upd720202-datasheet?r=1260536; DESCRIPTION: QFN-68-EP(8x8) USB Converters ROHS; LCSC_PART: C355375
IC2 = ds_ic_vreg:TPS5450; DATASHEET: https://www.ti.com/general/docs/suppproductinfo.tsp?distId=10&gotoUrl=https%3A%2F%2Fwww.ti.com%2Flit%2Fgpn%2Ftps5450-q1; DESCRIPTION: Step-down type Adjustable 1.221V~31.32V 5A 5.5V~36V SOP-8-EP-150mil DC-DC Converters ROHS; LCSC_PART: C114425
IC3 = ds_ic_vreg:TPS74401; DATASHEET: https://www.ti.com/lit/ds/symlink/tps74401.pdf?HQS=dis-dk-null-digikeymode-dsf-pf-null-wwe&ts=1748791211699&ref_url=https%253A%252F%252Fwww.ti.com%252Fgeneral%252Fdocs%252Fsuppproductinfo.tsp%253FdistId%253D10%2526gotoUrl%253Dhttps%253A%252F%252Fwww.ti.com%252Flit%252Fgpn%252Ftps74401; DESCRIPTION: 68dB@(120Hz) 3A Adjustable 800mV~3.6V Positive electrode 5.5V VQFN-20-EP(5x5) Voltage Regulators - Linear, Low Drop Out (LDO) Regulators ROHS; LCSC_PART: C840108
IC4 IC5 = ds_ic_vreg:TPS2560DRCR; COPYRIGHT: Copyright (C) 2025 Ultra Librarian. All rights reserved.; DESCRIPTION: VSON-10-EP(3x3) Power Distribution Switches ROHS; LCSC_PART: C140304; MANUFACTURER_PART_NUMBER: TPS2560DRCR; MFR_NAME: Texas Instruments
IC6 = MCU:MIC5504-3.3YM5-TR
IC7 IC10 = ds_ic_logic:74LVC541: SNx4LVC541A Octal Buffers/Drivers With 3-State Outputs
IC8 = ds_ic_memory:CAT24C256: The CAT24C256 is a EEPROM Serial 256−Kb I2C, internally organized as 32,768 words of 8 bits each. It features a 64−byte page write buffer and supports the Standard (100 kHz), Fast (400 kHz) and Fast−Plus (1 MHz) I2C protocol. Write operations can be inhibited by taking the WP pin High (this protects the entire memory). External address pins make it possible to address up to eight CAT24C256 devices on the same bus. On−Chip ECC (Error Correction Code) makes the device suitable for high reliability applications.
IC9 = ds_ic_mcu:CY7C68013A-56QFNLFXC: EZ-USB FX2LP USB Microcontroller High-Speed USB Peripheral Controller
IC11 = ds_ic_peripherals:FT4232H: FT4232H Quad High-Speed USB to Multi-Purpose UART/MPSSE IC; DATASHEET: https://ftdichip.com/wp-content/uploads/2024/05/DS_FT4232H.pdf; DESCRIPTION: USB to UART UART LQFP-64(10x10) USB Converters ROHS; LCSC_PART: C56742
IC12 = ds_ic_memory:93LC56BT: 2K Microwire Compatible Serial EEPROM; DATASHEET: https://ww1.microchip.com/downloads/aemDocuments/documents/MPD/ProductDocuments/DataSheets/93AA56X-93LC56X-93C56X-2-Kbit-Microwire-Compatible-Serial-EEPROM-Data-Sheet.pdf; DESCRIPTION: 2Kbit SPI SOT-23-6 EEPROM ROHS; LCSC_PART: C190271
IC13 IC25 = ds_ic_vreg:MIC5504-3.3YM5-TR: The MIC5501/2/3/4 is an advanced general-purpose LDO ideal for powering general-purpose portable devices. The MIC5501/2/3/4 family of products provides a high-performance 300mA LDO; DATASHEET: https://ww1.microchip.com/downloads/en/DeviceDoc/MIC5501-02-03-04-300mA-Single-Output-LDO-in-Small-Packages-DS20006006B.pdf; DESCRIPTION: SOT-23-5 Voltage Regulators - Linear, Low Drop Out (LDO) Regulators ROHS; LCSC_PART: C41348078
IC14 = ds_ic_opa:LMV611MFX: MV61x Single, Dual, and Quad, 1.4-MHz, Low-Power, General-Purpose 1.8-V Operational Amplifiers; DATASHEET: https://www.ti.com/lit/ds/symlink/lmv611.pdf?ts=1749071328501; DESCRIPTION: Single 14nA 0.42V/us 1.5MHz SOT-23-5 Operational Amplifier ROHS; LCSC_PART: C165135
IC15-IC17 = ds_ic_peripherals:TXB0108: TXB0108 8-Bit Bidirectional Voltage-Level Translator with Auto-Direction Sensing and ±15-kV ESD Protection; DATASHEET: https://www.ti.com/lit/ds/symlink/txs0108e.pdf; DESCRIPTION: 1.65V~5.5V 1 8 1.4V~3.6V 60Mbps VQFN-20-EP(3.7x4.7) Translators, Level Shifters ROHS; LCSC_PART: C90706
IC18-IC20 = ds_ic_opa:TLV3501: 4.5ns, Rail-to-Rail, High Speed Comparator with Shutdown; DATASHEET: https://www.ti.com/lit/ds/symlink/tlv3502.pdf?ts=1749128525689; DESCRIPTION: 6.5mV 10pA SOT-23-6 Comparators ROHS; LCSC_PART: C193413
IC21 = ds_ic_mcu:RP2040; DESCRIPTION: 133MHz LQFN-56(7x7) Microcontrollers (MCU/MPU/SOC) ROHS; LCSC_PART: C2040
IC22 = ds_ic_memory:W25Q128JV: 3V 128M-BIT SERIAL FLASH MEMORY WITH DUAL/QUAD SPI & QPI & DTR
IC23 IC24 = ds_ic_logic:74AUP1T17GW: Low-power buffer with voltage-level translator; DATASHEET: https://assets.nexperia.com/documents/data-sheet/74AUP1T17.pdf; DESCRIPTION: Schmitt Trigger 4mA 2.3V~3.6V 4mA TSSOP-5-1.3mm Buffers, Drivers, Receivers, Transceivers ROHS; LCSC_PART: C545951
J1 J7 = ds_passive:JUMPER-NO
J2 J3 = ds_passive:JUMPER-3
J4 = Wurth_Connectors_WR-WTB:66100511622: WR-WTB 2.54 mm Male Vertical Shrouded Header KIND PROPERTIES: Pitch:2.54 mm Gender:Male MATERIAL PROPERTIES: Insulator Material :PA46 Insulator Flammability Rating:UL94 V-0 Color:Black Contact Material:Phosphor Bronze Contact Plating:Tin GENERAL INFORMATION Operating Temperature:-40 up to +105 °C Compliance: RoHS Working Voltage:50 V (AC) Withstanding Voltage:500 V (AC) Contact Resistance:20 mΩ PACKAGING PROPERTIES Packaging:Box <https://katalog.we-online.com/media/images/v2/o58903v209%20Family_WR-WTB_6610xx11622_2%2054.jpg> Details see: https://katalog.we-online.com/en/em/WTB_2_54_MALE_VERTICAL_SHROUDED_HEADER_GLOW_WIRE_PLASTIC_6610XXX1622 Updated by Yingchun,Shan 2019-11-05 2019 (C) Würth Elektronik; CONTACT-RESISTANCE: 20mOhm; DATASHEET-URL: https://www.we-online.com/redexpert/spec/66100511622?ae; GENDER: Male; IR: 3A; L: 12.4mm; MOUNT: THT; PACKAGING: Box; PART-NUMBER: 66100511622; PCB-CABLE-PANEL: PCB; PINS: 5; PITCH: 2.54mm; TYPE: Vertical; WORKING-VOLTAGE: 50V(AC)
JTAG = Wurth_Connectors_WR-BHD:6270XX21721_62701021721: WR-BHD 1.27 mm Male Angled Box Header KIND PROPERTIES: Pitch 1.27 mm Gender:Male MATERIAL PROPERTIES: Insulator Material Nylon 9T Insulator Flammability Rating UL94 V-0 Insulator Color Black Contact Material Brass Contact Plating Gold over Nickel GENERAL INFORMATION: Operating Temperature -40 up to +105 °C Working Voltage 50 V (AC) Withstanding Voltage 500 V (AC) Contact Resistance 20 mΩ RISO 1000 MΩ CERTIFICATION: UL Approval E323964 <https://www.we-online.com/catalog/media/o375402v209%20Family_WR-BHD_6270xx21721.jpg> Details see: https://www.we-online.com/catalog/en/WR_BHD_1_27_MM_MALE_ANGLED_BOX_HEADER Created by Ella Wu 2021-08-24 2021 (C) Würth Elektronik; CONTACT-RESISTANCE: 20mOhm; DATASHEET-URL: https://www.we-online.com/redexpert/spec/62701021721?ae; GENDER: Male; IR: 1A; LENGTH: 12.7mm; MOUNT: THT; PART-NUMBER: 62701021721; PINS: 10; PITCH: 1.27mm; TYPE: Angled; WORKING-VOLTAGE: 50V(AC)
L1 = ds_inductor:15UH; DESCRIPTION: 6.5A 15uH ±20% 8.5A 32mΩ SMD,10x11mm Inductors (SMD) ROHS; LCSC_PART: C2847564
LA = Wurth_Connectors_WR-BHD:6270XX21721_62702021721: WR-BHD 1.27 mm Male Angled Box Header KIND PROPERTIES: Pitch 1.27 mm Gender:Male MATERIAL PROPERTIES: Insulator Material Nylon 9T Insulator Flammability Rating UL94 V-0 Insulator Color Black Contact Material Brass Contact Plating Gold over Nickel GENERAL INFORMATION: Operating Temperature -40 up to +105 °C Working Voltage 50 V (AC) Withstanding Voltage 500 V (AC) Contact Resistance 20 mΩ RISO 1000 MΩ CERTIFICATION: UL Approval E323964 <https://www.we-online.com/catalog/media/o375402v209%20Family_WR-BHD_6270xx21721.jpg> Details see: https://www.we-online.com/catalog/en/WR_BHD_1_27_MM_MALE_ANGLED_BOX_HEADER Created by Ella Wu 2021-08-24 2021 (C) Würth Elektronik; CONTACT-RESISTANCE: 20mOhm; DATASHEET-URL: https://www.we-online.com/redexpert/spec/62702021721?ae; GENDER: Male; IR: 1A; LENGTH: 19.05mm; MOUNT: THT; PART-NUMBER: 62702021721; PINS: 20; PITCH: 1.27mm; TYPE: Angled; WORKING-VOLTAGE: 50V(AC)
PCIE-1X1 = ds_con:PCIE-1X-LOWPROFILE: PCIe 1x Low profile board
R1 = ds_resistor:0R; DESCRIPTION: 50mW Thick Film Resistors 25V ±1% 0Ω 0201 Chip Resistor - Surface Mount ROHS; LCSC_PART: C106227
R2 = ds_passive:R
R3 R9 R24-R26 R28 R36 R45 R47 R65 = ds_resistor:10K-1%; DESCRIPTION: 50mW Thick Film Resistors 25V ±1% ±200ppm/℃ 10kΩ 0201 Chip Resistor - Surface Mount ROHS; LCSC_PART: C473048
R4 = ds_resistor:1.6K-1%; DESCRIPTION: 50mW Thick Film Resistors ±1% ±200ppm/℃ 1.6kΩ 0201 Chip Resistor - Surface Mount ROHS; LCSC_PART: C6123628
R5 R12 R15-R18 R22 R54-R58 = ds_resistor:1K-1%; DESCRIPTION: 62.5mW Thick Film Resistors 50V ±100ppm/℃ ±1% 1kΩ 0402 Chip Resistor - Surface Mount ROHS; LCSC_PART: C11702
R6 R27 R31 R32 = ds_resistor:4.7K-1%; DESCRIPTION: 50mW Thick Film Resistors 25V ±1% ±200ppm/℃ 4.7kΩ 0201 Chip Resistor - Surface Mount ROHS; LCSC_PART: C270346
R7 R33 R35 R38 R39 = ds_resistor:10K-1%; DESCRIPTION: 62.5mW Thick Film Resistors 50V ±100ppm/℃ ±1% 10kΩ 0402 Chip Resistor - Surface Mount ROHS; LCSC_PART: C25744
R8 = ds_resistor:3.16K-1%; DESCRIPTION: 62.5mW Thick Film Resistors 50V ±100ppm/℃ ±1% 3.16kΩ 0402 Chip Resistor - Surface Mount ROHS; LCSC_PART: C2933087
R10 = ds_resistor:1.37K-1%; DESCRIPTION: 50mW Thick Film Resistors 25V ±1% ±200ppm/℃ 1.37kΩ 0201 Chip Resistor - Surface Mount ROHS; LCSC_PART: C166356
R11 = ds_resistor:4.42K-1%; DESCRIPTION: 50mW Thick Film Resistors 25V ±1% ±200ppm/℃ 4.42kΩ 0201 Chip Resistor - Surface Mount ROHS; LCSC_PART: C423515
R13 R14 = ds_resistor:30.9K-1%; DESCRIPTION: 50mW Thick Film Resistors 25V ±1% ±200ppm/℃ 30.9kΩ 0201 Chip Resistor - Surface Mount ROHS; LCSC_PART: C364366
R19 R37 R41 R42 = ds_resistor:100K-1%; DESCRIPTION: 50mW Thick Film Resistors 25V ±1% ±200ppm/℃ 100kΩ 0201 Chip Resistor - Surface Mount ROHS; LCSC_PART: C270364
R20 R21 = ds_resistor:3.3K-1%; DESCRIPTION: 50mW Thick Film Resistors 25V ±1% ±200ppm/℃ 3.3kΩ 0201 Chip Resistor - Surface Mount ROHS; LCSC_PART: C270350
R23 = ds_resistor:2K-1%; DESCRIPTION: 50mW Thick Film Resistors 25V ±1% ±200ppm/℃ 2kΩ 0201 Chip Resistor - Surface Mount ROHS; LCSC_PART: C270358
R29 = ds_resistor:12K-1%; DESCRIPTION: 50mW Thick Film Resistors 25V ±1% ±200ppm/℃ 12kΩ 0201 Chip Resistor - Surface Mount ROHS; LCSC_PART: C270363
R30 R50 R53 = ds_resistor:1K-1%; DESCRIPTION: 50mW Thick Film Resistors 25V ±1% ±200ppm/℃ 1kΩ 0201 Chip Resistor - Surface Mount ROHS; LCSC_PART: C270365
R34 = ds_resistor:22K-1%; DESCRIPTION: 62.5mW Thick Film Resistors 50V ±100ppm/℃ ±1% 22kΩ 0402 Chip Resistor - Surface Mount ROHS; LCSC_PART: C82868
R40 = ds_resistor:15K-1%; DESCRIPTION: 50mW Thick Film Resistors 25V ±1% ±200ppm/℃ 15kΩ 0201 Chip Resistor - Surface Mount ROHS; LCSC_PART: C295774
R43 R44 R48 = ds_resistor:1K-1%; DESCRIPTION: 100mW Thick Film Resistors 75V ±100ppm/℃ ±1% 1kΩ 0603 Chip Resistor - Surface Mount ROHS; LCSC_PART: C21190
R46 = ds_resistor:7.87K-1%; DESCRIPTION: 50mW Thick Film Resistors 25V ±1% ±200ppm/℃ 7.87kΩ 0201 Chip Resistor - Surface Mount ROHS; LCSC_PART: C473937
R49 = ds_resistor:4.3K-1%; DESCRIPTION: 50mW Thick Film Resistors 25V ±1% ±200ppm/℃ 4.3kΩ 0201 Chip Resistor - Surface Mount ROHS; LCSC_PART: C423525
R51 R52 = ds_resistor:27R-1%; DESCRIPTION: 50mW Thick Film Resistors 25V ±1% ±200ppm/℃ 27Ω 0201 Chip Resistor - Surface Mount ROHS; LCSC_PART: C473051
R59-R64 = ds_resistor:100R-1%; DESCRIPTION: 50mW Thick Film Resistors 25V ±1% ±200ppm/℃ 100Ω 0201 Chip Resistor - Surface Mount ROHS; LCSC_PART: C270366
RN1-RN4 RN7-RN10 = ds_resistor:100R-1%_ARRAY; DESCRIPTION: 4 ±1% 100Ω 62.5mW ±200ppm/℃ 0603x4 Resistor Networks, Arrays ROHS; LCSC_PART: C136838
RN5 RN6 RN11 RN12 = ds_resistor:100K-1%_ARRAY; DESCRIPTION: 4 ±1% 100kΩ 62.5mW ±200ppm/℃ 0603x4 Resistor Networks, Arrays ROHS; LCSC_PART: C110374
RPDBUG RPUART = ds_con:SM03B-SRSS-TB; DATASHEET: https://www.jst-mfg.com/product/pdf/eng/eSH.pdf; DESCRIPTION: 1x3P 3P SH Tin 3 -25℃~+85℃ 1A 1 1mm Brass Alloy Horizontal attachment SMD,P=1mm,Surface Mount，Right Angle Wire To Board Connector ROHS; LCSC_PART: C160403
SW1 SW2 = ds_passive:B3U-1000P: 2.5mm 1.6mm Round Button 50mA Standing paste 3mm SPST 153gf 12V SMD,2.5x3mm Tactile Switches ROHS; DATASHEET: https://omronfs.omron.com/en_US/ecb/products/pdf/en-b3u.pdf; DESCRIPTION: 2.5mm 1.6mm Round Button 50mA Standing paste 3mm SPST 153gf 12V SMD,2.5x3mm Tactile Switches ROHS; LCSC_PART: C231329
T1 T2 = ds_active:BSS138
UART1 UART2 = Wurth_Connectors_WR-BHD:6273XX20621_62731020621: WR-BHD 1.27 mm Male SMT Box Header KIND PROPERTIES: Pitch 1.27 mm Gender:Male MATERIAL PROPERTIES: Insulator Material Nylon 9T Insulator Flammability Rating UL94 V-0 Insulator Color Black Contact Material Brass Contact Plating Gold over Nickel GENERAL INFORMATION: Operating Temperature -40 up to +105 °C Working Voltage 50 V (AC) Withstanding Voltage 500 V (AC) Contact Resistance 20 mΩ RISO 1000 MΩ CERTIFICATION: UL Approval E323964 <https://www.we-online.com/catalog/media/o375406v209%20Family_WR-BHD_6270xx20621.jpg> Details see: https://www.we-online.com/catalog/en/WR_BHD_1_27_MM_MALE_SMT_BOX_HEADER Created by Ella Wu 2021-08-24 2021 (C) Würth Elektronik; CONTACT-RESISTANCE: 20mOhm; DATASHEET-URL: https://www.we-online.com/redexpert/spec/62731020621?ae; GENDER: Male; IR: 1A; LENGTH: 12.7mm; MOUNT: SMT; PART-NUMBER: 62731020621; PINS: 10; PITCH: 1.27mm; TYPE: Straight; WORKING-VOLTAGE: 50V(AC)
X1 = Wurth_Quartz Crystals & Oscillators_WE-XTAL:WE-XTAL_CFPX-180: WE-XTAL Quartz Crystal Characteristics SMT and THT models Hermetically sealed Frequencies between 1.8432 MHz and 50 MHz Tolerances down to ±10 ppm available Maximum operating temperatures range: -40 °C to 85 °C Stabilities down to ±10 ppm available Applications Microprocessor Wireless Communication Devices Industrial Devices Wired Communication (e.g. Ethernet and USB) IoT Optical Network Audio and Multimedia Devices Test and Measurement Equipment Navigation and Locators Wearables <https://www.we-online.com/catalog/media/o135919v209%20Family_WE-XTAL_IQXC-42.jpg> Details see: https://www.we-online.com/catalog/en/WE-XTAL Updated by Ella Wu , 2020-11-23 2020 (C) Wurth Elektronik; C-LOAD: 8pF; DATASHEET-URL: https://www.we-online.com/catalog/datasheet/830108207709.pdf; MOUNT: SMT; PART-NUMBER: 830108207709; STABILITY: 20ppm; TOLERANCE: ±10ppm; VALUE: 40.0MHz
X2 = Wurth_Quartz Crystals & Oscillators_WE-XTAL:WE-XTAL_CFPX-180: WE-XTAL Quartz Crystal Characteristics SMT and THT models Hermetically sealed Frequencies between 1.8432 MHz and 50 MHz Tolerances down to ±10 ppm available Maximum operating temperatures range: -40 °C to 85 °C Stabilities down to ±10 ppm available Applications Microprocessor Wireless Communication Devices Industrial Devices Wired Communication (e.g. Ethernet and USB) IoT Optical Network Audio and Multimedia Devices Test and Measurement Equipment Navigation and Locators Wearables <https://www.we-online.com/catalog/media/o135919v209%20Family_WE-XTAL_IQXC-42.jpg> Details see: https://www.we-online.com/catalog/en/WE-XTAL Updated by Ella Wu , 2020-11-23 2020 (C) Wurth Elektronik; C-LOAD: 10pF; DATASHEET-URL: https://www.we-online.com/catalog/datasheet/830058149.pdf; MOUNT: SMT; PART-NUMBER: 830058149; STABILITY: 10ppm; TOLERANCE: ±10ppm
X3 X4 = Wurth_Quartz Crystals & Oscillators_WE-XTAL:WE-XTAL_CFPX-180: WE-XTAL Quartz Crystal Characteristics SMT and THT models Hermetically sealed Frequencies between 1.8432 MHz and 50 MHz Tolerances down to ±10 ppm available Maximum operating temperatures range: -40 °C to 85 °C Stabilities down to ±10 ppm available Applications Microprocessor Wireless Communication Devices Industrial Devices Wired Communication (e.g. Ethernet and USB) IoT Optical Network Audio and Multimedia Devices Test and Measurement Equipment Navigation and Locators Wearables <https://www.we-online.com/catalog/media/o135919v209%20Family_WE-XTAL_IQXC-42.jpg> Details see: https://www.we-online.com/catalog/en/WE-XTAL Updated by Ella Wu , 2020-11-23 2020 (C) Wurth Elektronik; C-LOAD: 18pF; DATASHEET-URL: https://www.we-online.com/catalog/datasheet/830055295.pdf; MOUNT: SMT; PART-NUMBER: 830055295; STABILITY: 30ppm; TOLERANCE: ±20ppm

## Net classes
0 50R_SE: width 0.149 mm, drill 0.15 mm, clearance 0.178 mm
1 90R_DE: width 0.149 mm, drill 0.15 mm, clearance 0.178 mm
2 100R_DE: width 0.115 mm, drill 0.15 mm, clearance 0.178 mm
3 50R_SE_INNER: width 0.369 mm, drill 0.15 mm, clearance 0.178 mm